# Altium project pcb_88.PrjPcb
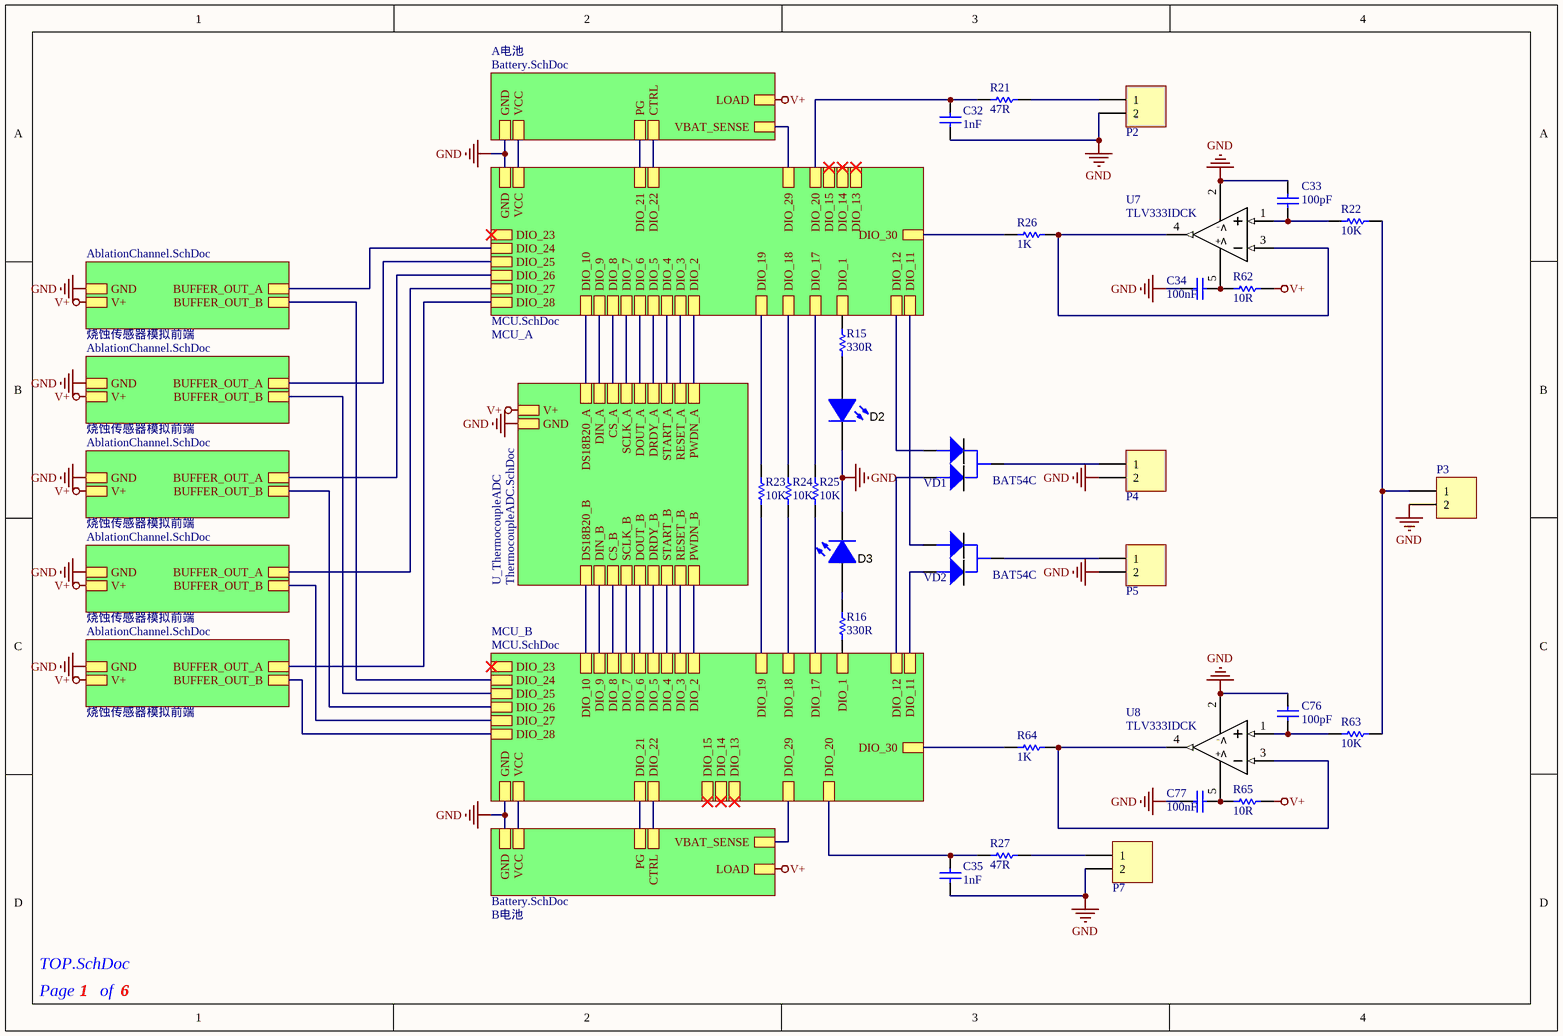
[diagram p0: TOP.SchDoc]
6 sheets, 395 parts. Net scope: hierarchical (ports join the sheet entries above them; power ports are global).
Board file: pcb_88.PcbDoc
Sheets:
  TOP.SchDoc
    U_Battery = Battery.SchDoc
    U_MCU = MCU.SchDoc
    U_AblationChannel = AblationChannel.SchDoc
    U_MCU = MCU.SchDoc
    U_AblationChannel = AblationChannel.SchDoc
    U_AblationChannel = AblationChannel.SchDoc
    U_AblationChannel = AblationChannel.SchDoc
    U_AblationChannel = AblationChannel.SchDoc
    U_Battery = Battery.SchDoc
    U_ThermocoupleADC = ThermocoupleADC.SchDoc
      U_Thermocouple channel = ThermocoupleFrontEnd.SchDoc
      U_Thermocouple channel = ThermocoupleFrontEnd.SchDoc
      U_Thermocouple channel = ThermocoupleFrontEnd.SchDoc
      U_Thermocouple channel = ThermocoupleFrontEnd.SchDoc
      U_Thermocouple channel = ThermocoupleFrontEnd.SchDoc

## Sheet TOP.SchDoc
size A4; DrawnBy: YuJian; SheetNumber: 1; SheetTotal: 6

### Parts
C32  1nF  [R0603_C]
C33  100pF  [R0603_C]
C34  100nF  [R0603_C]
C35  1nF  [R0603_C]
C76  100pF  [R0603_C]
C77  100nF  [R0603_C]
D2  MHT192WDT-C2  [LED_0603_RED]  (value not drawn)
D3  MHT192WDT-C2  [LED_0603_RED]  (value not drawn)
P2  Header 2  [CP1X2]  (value not drawn)
P3  Header 2  [CP1X2]  (value not drawn)
P4  Header 2  [CP1X2]  (value not drawn)
P5  Header 2  [CP1X2]  (value not drawn)
P7  Header 2  [CP1X2]  (value not drawn)
R15  330R  [R0603_R]
R16  330R  [R0603_R]
R21  47R  [R0603_R]
R22  10K  [R0603_R]
R23  10K  [R0603_R]
R24  10K  [R0603_R]
R25  10K  [R0603_R]
R26  1K  [R0603_R]
R27  47R  [R0603_R]
R62  10R  [R0603_R]
R63  10K  [R0603_R]
R64  1K  [R0603_R]
R65  10R  [R0603_R]
U7  TLV333IDCK  [DCK0005A_N]
U8  TLV333IDCK  [DCK0005A_N]
VD1  BAT54C  [SOT-23(SOT-23-3)]
VD2  BAT54C  [SOT-23(SOT-23-3)]

### Sub-sheets
U_AblationChannel = AblationChannel.SchDoc: BUFFER_OUT_A, GND, BUFFER_OUT_B, V+  | Parameter 2: 烧蚀传感器模拟前端
U_AblationChannel = AblationChannel.SchDoc: BUFFER_OUT_A, GND, BUFFER_OUT_B, V+  | Parameter 2: 烧蚀传感器模拟前端
U_AblationChannel = AblationChannel.SchDoc: BUFFER_OUT_A, GND, BUFFER_OUT_B, V+  | Parameter 2: 烧蚀传感器模拟前端
U_AblationChannel = AblationChannel.SchDoc: BUFFER_OUT_A, GND, BUFFER_OUT_B, V+  | Parameter 2: 烧蚀传感器模拟前端
U_AblationChannel = AblationChannel.SchDoc: BUFFER_OUT_A, GND, BUFFER_OUT_B, V+  | Parameter 2: 烧蚀传感器模拟前端
U_Battery = Battery.SchDoc: LOAD, CTRL, PG, VCC, GND, VBAT_SENSE  | Parameter 2: B电池
U_Battery = Battery.SchDoc: LOAD, CTRL, PG, VCC, GND, VBAT_SENSE  | Parameter 2: A电池
U_MCU = MCU.SchDoc: DIO_2, DIO_3, DIO_4, DIO_5, DIO_6, DIO_1, DIO_8, DIO_9, DIO_10, DIO_11, DIO_12, DIO_13, DIO_14, DIO_15, DIO_17, DIO_18, DIO_19, DIO_20, DIO_21, DIO_22, DIO_23, DIO_24, DIO_25, DIO_26, DIO_27, DIO_28, DIO_29, DIO_30, GND, VCC, DIO_7  | Parameter 2: MCU_B
U_MCU = MCU.SchDoc: DIO_2, DIO_3, DIO_4, DIO_5, DIO_6, DIO_1, DIO_8, DIO_9, DIO_10, DIO_11, DIO_12, DIO_13, DIO_14, DIO_15, DIO_17, DIO_18, DIO_19, DIO_20, DIO_21, DIO_22, DIO_23, DIO_24, DIO_25, DIO_26, DIO_27, DIO_28, DIO_29, DIO_30, GND, VCC, DIO_7  | Parameter 2: MCU_A
U_ThermocoupleADC = ThermocoupleADC.SchDoc: GND, V+, DS18B20_A, DRDY_A, SCLK_A, CS_A, DIN_A, DOUT_A, PWDN_A, START_A, RESET_A, DS18B20_B, DRDY_B, SCLK_B, CS_B, DIN_B, DOUT_B, PWDN_B, START_B, RESET_B

### Nets
GND: C32.1 C33.1 C34.1 C35.1 C76.1 C77.1 D2.2(K) D3.2(K) P2.2 P3.2 P4.2 P5.2 P7.2 U7.2(V-) U8.2(V-) ; sheet U_Battery/GND, sheet U_MCU/GND, sheet U_AblationChannel/GND, sheet U_MCU/GND, sheet U_AblationChannel/GND, sheet U_AblationChannel/GND, sheet U_AblationChannel/GND, sheet U_AblationChannel/GND, sheet U_Battery/GND, sheet U_ThermocoupleADC/GND
V+: R62.2 R65.2 ; sheet U_Battery/LOAD, sheet U_AblationChannel/V+, sheet U_AblationChannel/V+, sheet U_AblationChannel/V+, sheet U_AblationChannel/V+, sheet U_AblationChannel/V+, sheet U_Battery/LOAD, sheet U_ThermocoupleADC/V+
VCC: sheet U_Battery/VCC, sheet U_MCU/VCC, sheet U_MCU/VCC, sheet U_Battery/VCC
NetC32_2: C32.2 R21.1 ; sheet U_MCU/DIO_20
NetC33_2: C33.2 R22.2 U7.1(IN+)
NetC34_2: C34.2 R62.1 U7.5(V+)
NetC35_2: C35.2 R27.1 ; sheet U_MCU/DIO_20
NetC76_2: C76.2 R63.2 U8.1(IN+)
NetC77_2: C77.2 R65.1 U8.5(V+)
NetD2_1: D2.1(A) R15.1
NetD3_1: D3.1(A) R16.2
NetP2_1: P2.1 R21.2
NetP3_1: P3.1 R22.1 R63.1
NetP4_1: P4.1 VD1.3(K)
NetP5_1: P5.1 VD2.3(K)
NetP7_1: P7.1 R27.2
NetR3A_2: sheet U_AblationChannel/BUFFER_OUT_A, sheet U_MCU/DIO_24
NetR3B_2: sheet U_MCU/DIO_25, sheet U_AblationChannel/BUFFER_OUT_A
NetR3C_2: sheet U_MCU/DIO_26, sheet U_AblationChannel/BUFFER_OUT_A
NetR3D_2: sheet U_MCU/DIO_27, sheet U_AblationChannel/BUFFER_OUT_A
NetR3E_2: sheet U_MCU/DIO_28, sheet U_AblationChannel/BUFFER_OUT_A
NetR6A_2: sheet U_MCU/DIO_24, sheet U_AblationChannel/BUFFER_OUT_B
NetR6B_2: sheet U_MCU/DIO_25, sheet U_AblationChannel/BUFFER_OUT_B
NetR6C_2: sheet U_MCU/DIO_26, sheet U_AblationChannel/BUFFER_OUT_B
NetR6D_2: sheet U_MCU/DIO_27, sheet U_AblationChannel/BUFFER_OUT_B
NetR6E_2: sheet U_MCU/DIO_28, sheet U_AblationChannel/BUFFER_OUT_B
NetR12A_1: sheet U_Battery/PG, sheet U_MCU/DIO_21
NetR12B_1: sheet U_MCU/DIO_21, sheet U_Battery/PG
NetR14A_2: sheet U_Battery/CTRL, sheet U_MCU/DIO_22
NetR14B_2: sheet U_MCU/DIO_22, sheet U_Battery/CTRL
NetR15_2: R15.2 ; sheet U_MCU/DIO_1
NetR16_1: R16.1 ; sheet U_MCU/DIO_1
NetR23_1: R23.1 ; sheet U_MCU/DIO_19
NetR23_2: R23.2 ; sheet U_MCU/DIO_19
NetR24_1: R24.1 ; sheet U_MCU/DIO_18
NetR24_2: R24.2 ; sheet U_MCU/DIO_18
NetR25_1: R25.1 ; sheet U_MCU/DIO_17
NetR25_2: R25.2 ; sheet U_MCU/DIO_17
NetR26_1: R26.1 U7.3(IN-) U7.4(OUT)
NetR26_2: R26.2 ; sheet U_MCU/DIO_30
NetR28_2: sheet U_MCU/DIO_5, sheet U_ThermocoupleADC/DRDY_A
NetR30_2: sheet U_MCU/DIO_8, sheet U_ThermocoupleADC/CS_A
NetR31_2: sheet U_MCU/DIO_7, sheet U_ThermocoupleADC/SCLK_A
NetR32_2: sheet U_MCU/DIO_9, sheet U_ThermocoupleADC/DIN_A
NetR33_2: sheet U_MCU/DIO_6, sheet U_ThermocoupleADC/DOUT_A
NetR40_1: sheet U_MCU/DIO_10, sheet U_ThermocoupleADC/DS18B20_A
NetR41_2: sheet U_MCU/DIO_5, sheet U_ThermocoupleADC/DRDY_B
NetR43_2: sheet U_MCU/DIO_8, sheet U_ThermocoupleADC/CS_B
NetR44_2: sheet U_MCU/DIO_7, sheet U_ThermocoupleADC/SCLK_B
NetR45_2: sheet U_MCU/DIO_9, sheet U_ThermocoupleADC/DIN_B
NetR46_2: sheet U_MCU/DIO_6, sheet U_ThermocoupleADC/DOUT_B
NetR53_1: sheet U_MCU/DIO_10, sheet U_ThermocoupleADC/DS18B20_B
NetR64_1: R64.1 U8.3(IN-) U8.4(OUT)
NetR64_2: R64.2 ; sheet U_MCU/DIO_30
NetR68_2: sheet U_MCU/DIO_2, sheet U_ThermocoupleADC/PWDN_A
NetR69_2: sheet U_MCU/DIO_3, sheet U_ThermocoupleADC/RESET_A
NetR70_2: sheet U_MCU/DIO_4, sheet U_ThermocoupleADC/START_A
NetR71_2: sheet U_MCU/DIO_2, sheet U_ThermocoupleADC/PWDN_B
NetR72_2: sheet U_MCU/DIO_3, sheet U_ThermocoupleADC/RESET_B
NetR73_2: sheet U_MCU/DIO_4, sheet U_ThermocoupleADC/START_B
NetU5A_3: sheet U_Battery/VBAT_SENSE, sheet U_MCU/DIO_29
NetU5B_3: sheet U_MCU/DIO_29, sheet U_Battery/VBAT_SENSE
NetU9A_17: VD2.2(A2) ; sheet U_MCU/DIO_11
NetU9A_18: VD1.2(A2) ; sheet U_MCU/DIO_12
NetU9B_17: VD2.1(A1) ; sheet U_MCU/DIO_11
NetU9B_18: VD1.1(A1) ; sheet U_MCU/DIO_12

### Notes on the sheet
- Page
- of

### Library data of the parts
C32 C35 = 1nF/0603/50V: 精度 ±5% / 容值 1nF / 额定电压 50V / 温漂系数（介质材料) C0G; 厂家: FH(风华); 型号: 0603CG102J500NT; 封装: 0603; 类型: Capacitor; 订货编码: C1636
C33 C76 = 100pF/0603/50V: 精度 ±5% / 容值 100pF / 额定电压 50V / 温漂系数（介质材料) C0G; 厂家: FH(风华); 型号: 0603CG101J500NT; 封装: 0603; 类型: Capacitor; 订货编码: C1635
C34 C77 = 100nF/0603/50V: 精度 ±10% / 容值 100nF / 额定电压 50V / 温漂系数（介质材料) X7R; 厂家: FH(风华); 型号: 0603B104K500NT; 封装: 0603; 类型: Capacitor; 订货编码: C30926
D2 D3 = MHT192WDT-C2: LED SMD贴片0603顶部发光 / 黄色雾状胶体，高亮白色光 / 电压VF:2.6-3.1V@5mA / 亮度Iv:228-450mcd@5mA / 坐标x:0.3,y:0.3 / 发光角度:120deg; 厂家: MEIHUA(美华科技); 封装: 0603; 订货编码: C389521; 型号: MHT192WDT-C2; 类型: LED
P2-P5 P7 = Header 2: Header, 2-Pin; 厂家: /; System: Connector; 型号: /; 封装: /; 类型: /; 订货编码: /
R15 R16 = 330R/0603: 精度 ±1% / 温度系数 ±100ppm/℃ / 阻值 330Ω / 功率 0.1W; 厂家: FH(风华); 型号: RS-03K3300FT; 类型: Resistor; 订货编码: C125768; 封装: 0603
R21 R27 = 47R/0603: 精度 ±1% / 温度系数 ±100ppm/℃ / 阻值 47Ω / 功率 0.1W; 厂家: FH(风华); 型号: RS-03K47R0FT; 类型: Resistor; 订货编码: C140087; 封装: 0603
R22-R25 R63 = 10K/0603: 精度 ±1% / 温度系数 ±100ppm/℃ / 阻值 10kΩ / 功率 0.1W; 厂家: FH(风华); 型号: RS-03K1002FT; 类型: Resistor; 订货编码: C115324; 封装: 0603
R26 R64 = 1K/0603: 精度 ±1% / 温度系数 ±100ppm/℃ / 阻值 1kΩ / 功率 0.1W; 厂家: FH(风华); 型号: RS-03K1001FT; 类型: Resistor; 订货编码: C115325; 封装: 0603
R62 R65 = 10R/0603: 精度 ±1% / 阻值 10Ω / 温度系数 ±100ppm/℃ / 功率 0.1W; 厂家: FH(风华); 型号: RS-03K10R0FT; 类型: Resistor; 订货编码: C136596; 封装: 0603
U7 U8 = TLV333IDCK: 电源电压 1.8V ~ 5.5V, ±0.9V ~ 2.75V / 增益带宽积（GBP） 350kHz / 压摆率（SR） 0.16 V/us / 工作温度 -40°C ~ 125°C /; 厂家: TI(德州仪器); 封装: SC-70-5; 类型: 运放; 订货编码: C181502; 型号: TLV333IDCK
VD1 VD2 = BAT54C: 共阴极，IF=0.2A,VRRM=30V,VF=0.24V@0.1mA,IR=2uA@25V,trr=5ns,SOT23-3,-55℃～150℃; 厂家: Nexperia(安世); 型号: BAT54C,215; 封装: SOT-23-3; 类型: 肖特基二极管; 订货编码: C37704

## Sheet Battery.SchDoc
size A4; SheetNumber: 3; SheetTotal: 6
Used 2 times, as channels U_Battery, U_Battery. Parts and nets are listed once, with the designators drawn on the sheet.
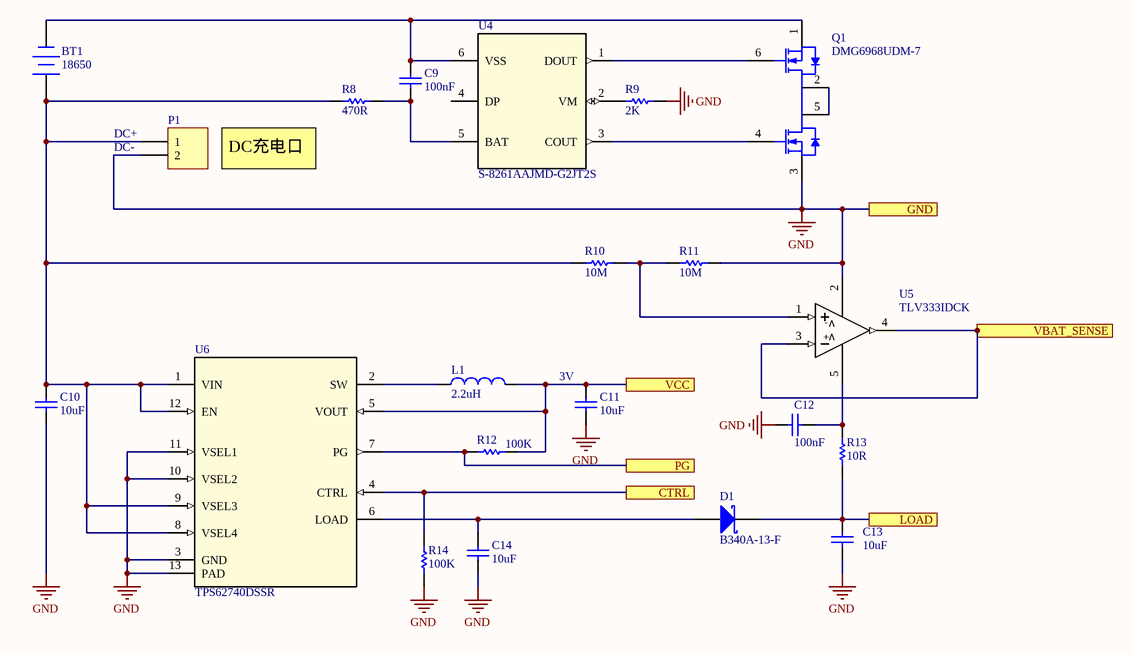
[diagram p1: Battery.SchDoc]

### Parts
BT1  18650  [CP1X2]
C9  100nF  [R0603_C]
C10  10uF  [R0805_C]
C11  10uF  [R0805_C]
C12  100nF  [R0603_C]
C13  10uF  [R0805_C]
C14  10uF  [R0805_C]
D1  B340A-13-F  [SMA(DO-214AC)_S2]
L1  2.2uH  [NR2016]
P1  Header 2  [CP1X2]  (value not drawn)
Q1  DMG6968UDM-7  [DBV0006A_N]
R8  470R  [R0603_R]
R9  2K  [R0603_R]
R10  10M  [R0603_R]
R11  10M  [R0603_R]
R12  100K  [R0603_R]
R13  10R  [R0603_R]
R14  100K  [R0603_R]
U4  S-8261AAJMD-G2JT2S  [DBV0006A_N]
U5  TLV333IDCK  [DCK0005A_N]
U6  TPS62740DSSR  [DSS0012A]

### Ports
CTRL, GND, LOAD, PG, VBAT_SENSE, VCC

### Nets
GND: C10.1 C11.1 C12.1 C13.1 C14.1 P1.2 Q1.3(S2) R9.2 R11.1 R14.1 U5.2(V-) U6.3(GND) U6.10(VSEL2) U6.11(VSEL1) U6.13(PAD) ; port GND
CTRL: R14.2 U6.4(CTRL) ; port CTRL
LOAD: C13.2 D1.2(K) R13.2 ; port LOAD
PG: R12.1 U6.7(PG) ; port PG
VBAT_SENSE: U5.3(IN-) U5.4(OUT) ; port VBAT_SENSE
VCC: C11.2 L1.2 R12.2 U6.5(VOUT) ; port VCC
NetBT1_1: BT1.1(+) C10.2 P1.1 R8.1 R10.2 U6.1(VIN) U6.8(VSEL4) U6.9(VSEL3) U6.12(EN)
NetBT1_2: BT1.2(-) C9.1 Q1.1(S1) U4.6(VSS)
NetC9_2: C9.2 R8.2 U4.5(BAT)
NetC12_2: C12.2 R13.1 U5.5(V+)
NetC14_2: C14.2 D1.1(A) U6.6(LOAD)
NetL1_1: L1.1 U6.2(SW)
NetQ1_2: Q1.2(D1/D2) Q1.5(D1/D2)
NetQ1_4: Q1.4(G2) U4.3(COUT)
NetQ1_6: Q1.6(G1) U4.1(DOUT)
NetR9_1: R9.1 U4.2(VM)
NetR10_1: R10.1 R11.2 U5.1(IN+)

Not connected (* = marked no-connect by the designer): U4 4(DP)

### Channels
U_Battery: designators end in A; ports CTRL=NetR14A_2 GND=GND LOAD=V+ PG=NetR12A_1 VBAT_SENSE=NetU5A_3 VCC=VCC
U_Battery: designators end in B; ports CTRL=NetR14B_2 GND=GND LOAD=V+ PG=NetR12B_1 VBAT_SENSE=NetU5B_3 VCC=VCC

### Notes on the sheet
- (near P1) DC+
- (near P1) DC-
- DC充电口
- (near C11) 3V
- Page
- of

### Library data of the parts
BT1 = Battery_18650_DIP: 18650单节直插电池仓; 型号: DIP-18650; 封装: DIP; 类型: 电池盒/电池座; System: Connector; 厂家: -; 订货编码: -
C9 C12 = 100nF/0603/50V: as C34 on sheet TOP
C10 C11 C13 C14 = 10uF/0805/16V: 精度 ±10% / 容值 10uF / 额定电压 16V / 温漂系数（介质材料) X7R; 厂家: FH(风华); 型号: 0805B106K160NT; 封装: 0805; 类型: Capacitor; 订货编码: C92341
D1 = B340A-13-F: 直流反向耐压（Vr） 40V / 平均整流电流（Io） 3A / 正向压降（Vf） 550mV @ 3A; 厂家: DIODES(美台); 封装: SMA; 类型: 肖特基二极管; 订货编码: C85098; 型号: B340A-13-F
L1 = 2.2uH/NR2016: 精度 ±20% / 饱和电流 1.3A / 温升电流1.15A / 直流电阻（内阻） 175mΩ / 电感值 2.2uH; 厂家: Sunlord(顺络); 型号: SPH201610U2R2MT; 类型: Inductor; 订货编码: C96796; 封装: NR2016
P1 = Header 2: Header, 2-Pin; 厂家: /; System: Connector; 型号: /; 封装: /; 类型: /; 订货编码: /
Q1 = DMG6968UDM-7: 漏源电压（Vdss） 20V / 连续漏极电流（Id）（25°C 时） 6.5A / 栅源极阈值电压 900mV @ 250uA / 漏源导通电阻 24mΩ @ 6.5A,4.5V / 最大功率耗散（Ta=25°C） 850mW / 类型 双N沟道(共漏); 厂家: DIODES(美台); 封装: SOT23-6; 类型: MOS(场效应管); 订货编码: C151635; 型号: DMG6968UDM-7
R8 = 470R/0603: 精度 ±1% / 温度系数 ±100ppm/℃ / 功率 0.1W; 厂家: FH(风华); 型号: RS-03K4700FT; 类型: Resistor; 订货编码: C116694; 封装: 0603
R9 = 2K/0603: 精度 ±1% / 阻值 2kΩ / 温度系数 ±100ppm/℃ / 功率 0.1W; 厂家: FH(风华); 型号: RS-03K2001FT; 类型: Resistor; 订货编码: C115336; 封装: 0603
R10 R11 = 10M/0603: 温度系数 ±250ppm/℃ / 精度 ±1% / 阻值 10MΩ / 功率 0.1W; 厂家: FH(风华); 型号: RS-03L1005FT; 类型: Resistor; 订货编码: C322040; 封装: 0603
R12 R14 = 100K/0603: 精度 ±1% / 阻值 100kΩ / 温度系数 ±100ppm/℃ / 功率 0.1W; 厂家: FH(风华); 型号: RS-03K1003FT; 类型: Resistor; 订货编码: C115320; 封装: 0603
R13 = 10R/0603: as R62 on sheet TOP
U4 = S-8261AAJMD-G2JT2S: 单节电池保护芯片 / 过充4.325V / 过放2.5V / 过流150mV; 厂家: ABLIC(艾普凌科); 封装: SOT23-6; 类型: 电池保护芯片; 订货编码: C125801; 型号: S-8261AAJMD-G2JT2S
U5 = TLV333IDCK: as U7 on sheet TOP; 型号: TLV333IDCK
U6 = TPS62740DSSR: DCDC; 厂家: TI(德州仪器); 类型: 电源芯片; 订货编码: C128606; 型号: TPS62740DSSR; 封装: DSS0012A

## Sheet MCU.SchDoc
size A4; DocumentNumber: 4; SheetNumber: 2; SheetTotal: 6
Used 2 times, as channels U_MCU, U_MCU. Parts and nets are listed once, with the designators drawn on the sheet.
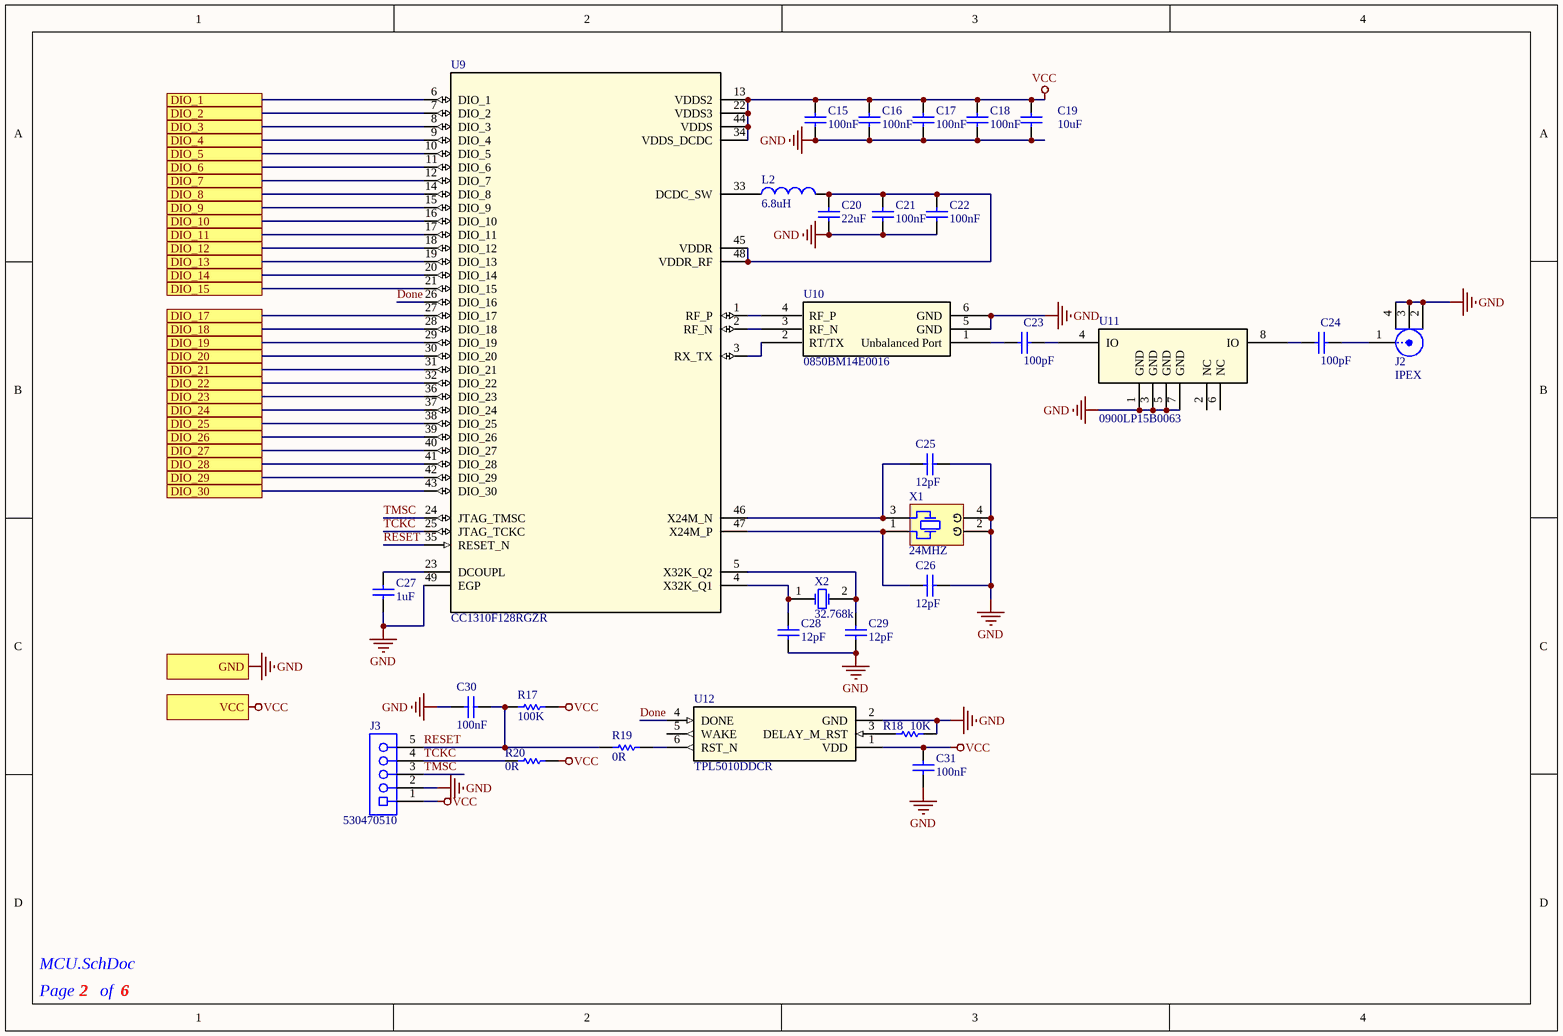
[diagram p2: MCU.SchDoc]

### Parts
C15  100nF  [R0603_C]
C16  100nF  [R0603_C]
C17  100nF  [R0603_C]
C18  100nF  [R0603_C]
C19  10uF  [R0805_C]
C20  22uF  [R0805_C]
C21  100nF  [R0603_C]
C22  100nF  [R0603_C]
C23  100pF  [R0402_C]
C24  100pF  [R0402_C]
C25  12pF  [R0402_C]
C26  12pF  [R0402_C]
C27  1uF  [R0603_C]
C28  12pF  [R0402_C]
C29  12pF  [R0402_C]
C30  100nF  [R0603_C]
C31  100nF  [R0603_C]
J2  IPEX  [molex-73412]
J3  530470510  [1.25mm_p5]
L2  6.8uH  [R0805_L]
R17  100K  [R0603_R]
R18  10K  [R0603_R]
R19  0R  [R0603_R]
R20  0R  [R0603_R]
U9  CC1310F128RGZR  [RGZ0048A]
U10  0850BM14E0016  [6P0603]
U11  0900LP15B0063  [8P0805]
U12  TPL5010DDCR  [DBV0006A_N]
X1  24MHZ  [SMD-3225]
X2  32.768k  [FC-135]

### Ports
DIO_1, DIO_2, DIO_3, DIO_4, DIO_5, DIO_6, DIO_7, DIO_8, DIO_9, DIO_10, DIO_11, DIO_12, DIO_13, DIO_14, DIO_15, DIO_17, DIO_18, DIO_19, DIO_20, DIO_21, DIO_22, DIO_23, DIO_24, DIO_25, DIO_26, DIO_27, DIO_28, DIO_29, DIO_30, GND, VCC

### Nets
GND: C15.1 C16.1 C17.1 C18.1 C19.1 C20.1 C21.1 C22.1 C25.1 C26.1 C27.1 C28.1 C29.1 C30.2 C31.1 J2.2 J2.3 J2.4 J3.2 R18.1 U9.49(EGP) U10.5(GND) U10.6(GND) U11.1(GND) U11.3(GND) U11.5(GND) U11.7(GND) U12.2(GND) X1.2(GND) X1.4(GND) ; port GND
VCC: C15.2 C16.2 C17.2 C18.2 C19.2 C31.2 J3.1 R17.2 R20.1 U9.13(VDDS2) U9.22(VDDS3) U9.34(VDDS_DCDC) U9.44(VDDS) U12.1(VDD) ; port VCC
DIO_1: U9.6(DIO_1) ; port DIO_1
DIO_2: U9.7(DIO_2) ; port DIO_2
DIO_3: U9.8(DIO_3) ; port DIO_3
DIO_4: U9.9(DIO_4) ; port DIO_4
DIO_5: U9.10(DIO_5) ; port DIO_5
DIO_6: U9.11(DIO_6) ; port DIO_6
DIO_7: U9.12(DIO_7) ; port DIO_7
DIO_8: U9.14(DIO_8) ; port DIO_8
DIO_9: U9.15(DIO_9) ; port DIO_9
DIO_10: U9.16(DIO_10) ; port DIO_10
DIO_11: U9.17(DIO_11) ; port DIO_11
DIO_12: U9.18(DIO_12) ; port DIO_12
DIO_13: U9.19(DIO_13) ; port DIO_13
DIO_14: U9.20(DIO_14) ; port DIO_14
DIO_15: U9.21(DIO_15) ; port DIO_15
DIO_17: U9.27(DIO_17) ; port DIO_17
DIO_18: U9.28(DIO_18) ; port DIO_18
DIO_19: U9.29(DIO_19) ; port DIO_19
DIO_20: U9.30(DIO_20) ; port DIO_20
DIO_21: U9.31(DIO_21) ; port DIO_21
DIO_22: U9.32(DIO_22) ; port DIO_22
DIO_23: U9.36(DIO_23) ; port DIO_23
DIO_24: U9.37(DIO_24) ; port DIO_24
DIO_25: U9.38(DIO_25) ; port DIO_25
DIO_26: U9.39(DIO_26) ; port DIO_26
DIO_27: U9.40(DIO_27) ; port DIO_27
DIO_28: U9.41(DIO_28) ; port DIO_28
DIO_29: U9.42(DIO_29) ; port DIO_29
DIO_30: U9.43(DIO_30) ; port DIO_30
Done: U9.26(DIO_16) U12.4(DONE)
RESET: C30.1 J3.5 R17.1 R19.2 U9.35(RESET_N)
TCKC: J3.4 R20.2 U9.25(JTAG_TCKC)
TMSC: J3.3 U9.24(JTAG_TMSC)
NetC20_2: C20.2 C21.2 C22.2 L2.2 U9.45(VDDR) U9.48(VDDR_RF)
NetC23_1: C23.1 U10.1(Unbalanced_Port)
NetC23_2: C23.2 U11.4(IO)
NetC24_1: C24.1 U11.8(IO)
NetC24_2: C24.2 J2.1
NetC25_2: C25.2 U9.46(X24M_N) X1.3
NetC26_2: C26.2 U9.47(X24M_P) X1.1
NetC27_2: C27.2 U9.23(DCOUPL)
NetC28_2: C28.2 U9.4(X32K_Q1) X2.1(OSC1)
NetC29_2: C29.2 U9.5(X32K_Q2) X2.2(OSC2)
NetL2_1: L2.1 U9.33(DCDC_SW)
NetR18_2: R18.2 U12.3(DELAY_M_RST)
NetR19_1: R19.1 U12.6(RST_N)
NetU9_1: U9.1(RF_P) U10.4(RF_P)
NetU9_2: U9.2(RF_N) U10.3(RF_N)
NetU9_3: U9.3(RX_TX) U10.2(RT/TX)

Not connected (* = marked no-connect by the designer): U11 2(NC) 6(NC); U12 5(WAKE)

### Channels
U_MCU: designators end in A; ports DIO_1=NetR16_1 DIO_2=NetR71_2 DIO_3=NetR72_2 DIO_4=NetR73_2 DIO_5=NetR41_2 DIO_6=NetR46_2 DIO_7=NetR44_2 DIO_8=NetR43_2 DIO_9=NetR45_2 DIO_10=NetR53_1 DIO_11=NetU9A_17 DIO_12=NetU9A_18 DIO_13=NetU9A_19 DIO_14=NetU9A_20 DIO_15=NetU9A_21 DIO_17=NetR25_1 DIO_18=NetR24_1 DIO_19=NetR23_1 DIO_20=NetC35_2 DIO_21=NetR12A_1 DIO_22=NetR14A_2 DIO_23=NetU9A_36 DIO_24=NetR6A_2 DIO_25=NetR6B_2 DIO_26=NetR6C_2 DIO_27=NetR6D_2 DIO_28=NetR6E_2 DIO_29=NetU5A_3 DIO_30=NetR64_2 GND=GND VCC=VCC
U_MCU: designators end in B; ports DIO_1=NetR15_2 DIO_2=NetR68_2 DIO_3=NetR69_2 DIO_4=NetR70_2 DIO_5=NetR28_2 DIO_6=NetR33_2 DIO_7=NetR31_2 DIO_8=NetR30_2 DIO_9=NetR32_2 DIO_10=NetR40_1 DIO_11=NetU9B_17 DIO_12=NetU9B_18 DIO_13=NetU9B_19 DIO_14=NetU9B_20 DIO_15=NetU9B_21 DIO_17=NetR25_2 DIO_18=NetR24_2 DIO_19=NetR23_2 DIO_20=NetC32_2 DIO_21=NetR12B_1 DIO_22=NetR14B_2 DIO_23=NetU9B_36 DIO_24=NetR3A_2 DIO_25=NetR3B_2 DIO_26=NetR3C_2 DIO_27=NetR3D_2 DIO_28=NetR3E_2 DIO_29=NetU5B_3 DIO_30=NetR26_2 GND=GND VCC=VCC

### Notes on the sheet
- Page
- of
- (in symbol X1E000021012700) G

### Library data of the parts
C15-C18 C21 C22 C30 C31 = 100nF/0603/50V: as C34 on sheet TOP
C19 = 10uF/0805/16V: as C10 on sheet Battery
C20 = 22uF/0805/16V: 精度 ±20% / 容值 22uF / 额定电压 16V / 温漂系数（介质材料) X5R; 厂家: FH(风华); 型号: 0805X226M160NT; 封装: 0805; 类型: Capacitor; 订货编码: C129302
C23 C24 = 100pF/0402/50V: 精度 ±5% / 容值 100pF / 额定电压 50V / 温漂系数（介质材料) C0G; 厂家: FH(风华); 型号: 0402CG101J500NT; 封装: 0402; 类型: Capacitor; 订货编码: C1546
C25 C26 C28 C29 = 12pF/0402/50V: 精度 ±1% / 容值 12pF / 额定电压 50V / 温漂系数（介质材料) C0G; 厂家: FH(风华); 型号: 0402CG120F500NT; 封装: 0402; 类型: Capacitor; 订货编码: C182477
C27 = 1uF/0603/50V: 精度 ±10% / 容值 1uF / 额定电压 50V / 温漂系数（介质材料) X7R; 厂家: FH(风华); 型号: 0603B105K500NT; 封装: 0603; 类型: Capacitor; 订货编码: C90540
J2 = 73412-0110: RF同轴连接器（天线座）; 厂家: MOLEX; 型号: 734120110; 封装: SMD; 类型: IPEX插座; 订货编码: C434806; System: Connector
J3 = Molex-530470510: MX1.25 直插 镀锡 5P 针座; 厂家: MOLEX; 封装: 1.25mm 5p; 类型: 连接器; 订货编码: C471412; System: Connector; 型号: 530470510
L2 = 6.8uH/0805: 精度 ±10% / 电感值 6.8uH / 直流电阻（内阻） 250mΩ / 额定电流 250mA; 厂家: FH(风华); 型号: CMP201209XD6R8KT; 封装: 0805; 类型: Inductor; 订货编码: C139247
R17 = 100K/0603: as R12 on sheet Battery
R18 = 10K/0603: as R22 on sheet TOP
R19 R20 = 0R/0603: 精度 ±1% / 阻值 0Ω / 功率 0.1W; 厂家: FH(风华); 型号: RS-03000FT; 类型: Resistor; 订货编码: C136582; 封装: 0603
U9 = CC1310F128RGZR: RF-MCU; 厂家: TI(德州仪器); 封装: VQFN-48; 类型: MCU; 订货编码: C84353; 型号: CC1310F128RGZR
U10 = 0850BM14E0016: 770 - 860 860 - 928MHz / -40°C to +85°C / Pmax 2W; 厂家: Johanson Technology; 类型: Balun; 型号: 0850BM14E0016; 封装: 6P0603; 订货编码: -
U11 = 0900LP15B0063: 863 - 960MHz / -40 to +85°C / 3Fo Attenuation (2589-2784MHz) 50dB / 2Fo Attenuation (1726-1856MHz) 59dB /; 厂家: Johanson Technology; 类型: 低通; 型号: 0900LP15B0063; 封装: 8P0805
U12 = TPL5010DDCR: 看门狗; 厂家: TI(德州仪器); 封装: SOT23-Thin-6; 订货编码: C473912; 型号: TPL5010DDCR; 类型: 看门狗
X1 = X1E000021012700: 等效串联电阻（ESR） 40Ω / 无源贴片晶振 / 主频 24MHz / 频率公差 ±10ppm / 负载电容值 9pF / 工作温度 -40℃~85℃; 厂家: EPSON(爱普生); 型号: X1A000061002100; 类型: 晶振; 订货编码: C89577; 封装: SMD-3225
X2 = FC-135 32.768KHz ±20ppm 12.5pF: 等效串联电阻（ESR） 70kΩ / 晶振类型 无源贴片晶振 / 主频 32.768KHz / 频率公差 ±20ppm / 负载电容值 12.5pF / 工作温度 -40℃~85℃; 厂家: EPSON(爱普生); 型号: Q13FC1350000400; 封装: SMD-3215_2P; 类型: 晶振; 订货编码: C32346

## Sheet AblationChannel.SchDoc
size A4; SheetNumber: 4; SheetTotal: 6
Used 5 times, as channels U_AblationChannel, U_AblationChannel, U_AblationChannel, U_AblationChannel, U_AblationChannel. Parts and nets are listed once, with the designators drawn on the sheet.
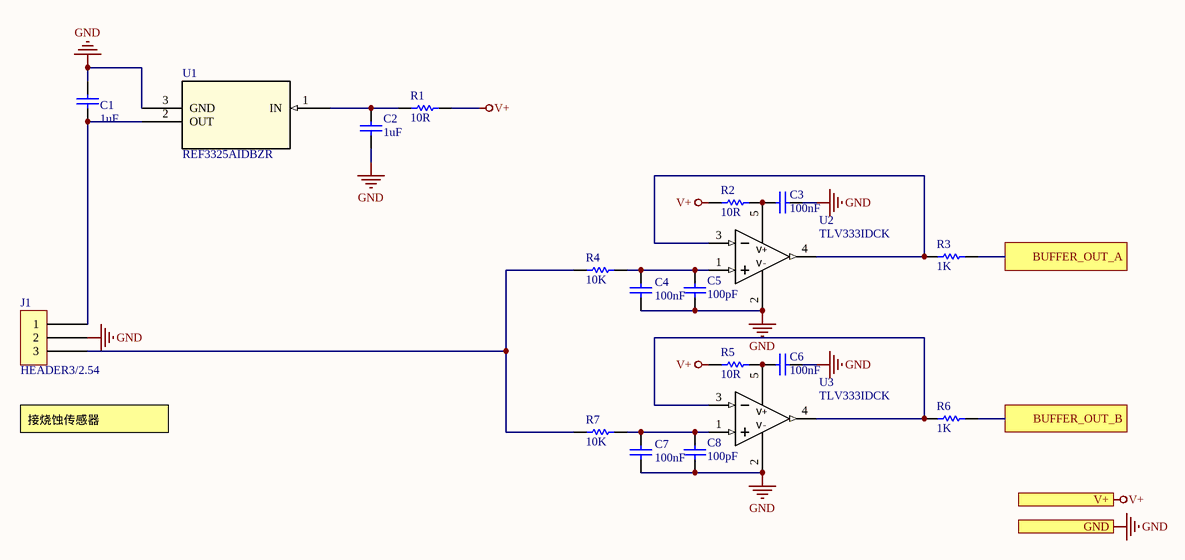
[diagram p3: AblationChannel.SchDoc]

### Parts
C1  1uF  [R0603_C]
C2  1uF  [R0603_C]
C3  100nF  [R0603_C]
C4  100nF  [R0603_C]
C5  100pF  [R0603_C]
C6  100nF  [R0603_C]
C7  100nF  [R0603_C]
C8  100pF  [R0603_C]
J1  HEADER3/2.54  [SIP3/2.54]
R1  10R  [R0603_R]
R2  10R  [R0603_R]
R3  1K  [R0603_R]
R4  10K  [R0603_R]
R5  10R  [R0603_R]
R6  1K  [R0603_R]
R7  10K  [R0603_R]
U1  REF3325AIDBZR  [SOT-23(SOT-23-3)]
U2  TLV333IDCK  [DCK0005A_N]
U3  TLV333IDCK  [DCK0005A_N]

### Ports
BUFFER_OUT_A, BUFFER_OUT_B, GND, V+

### Nets
GND: C1.1 C2.1 C3.1 C4.2 C5.1 C6.1 C7.2 C8.1 J1.2 U1.3(GND) U2.2(V-) U3.2(V-) ; port GND
V+: R1.1 R2.2 R5.2 ; port V+
BUFFER_OUT_A: R3.2 ; port BUFFER_OUT_A
BUFFER_OUT_B: R6.2 ; port BUFFER_OUT_B
NetC1_2: C1.2 J1.1 U1.2(OUT)
NetC2_2: C2.2 R1.2 U1.1(IN)
NetC3_2: C3.2 R2.1 U2.5(V+)
NetC4_1: C4.1 C5.2 R4.2 U2.1(IN+)
NetC6_2: C6.2 R5.1 U3.5(V+)
NetC7_1: C7.1 C8.2 R7.2 U3.1(IN+)
NetJ1_3: J1.3 R4.1 R7.1
NetR3_1: R3.1 U2.3(IN-) U2.4(OUT)
NetR6_1: R6.1 U3.3(IN-) U3.4(OUT)

### Channels
U_AblationChannel: designators end in A; ports BUFFER_OUT_A=NetR3A_2 BUFFER_OUT_B=NetR6A_2 GND=GND V+=V+
U_AblationChannel: designators end in B; ports BUFFER_OUT_A=NetR3B_2 BUFFER_OUT_B=NetR6B_2 GND=GND V+=V+
U_AblationChannel: designators end in C; ports BUFFER_OUT_A=NetR3C_2 BUFFER_OUT_B=NetR6C_2 GND=GND V+=V+
U_AblationChannel: designators end in D; ports BUFFER_OUT_A=NetR3D_2 BUFFER_OUT_B=NetR6D_2 GND=GND V+=V+
U_AblationChannel: designators end in E; ports BUFFER_OUT_A=NetR3E_2 BUFFER_OUT_B=NetR6E_2 GND=GND V+=V+

### Notes on the sheet
- 接烧蚀传感器
- Page
- of

### Library data of the parts
C1 C2 = 1uF/0603/50V: as C27 on sheet MCU
C3 C4 C6 C7 = 100nF/0603/50V: as C34 on sheet TOP
C5 C8 = 100pF/0603/50V: as C33 on sheet TOP
J1 = HEADER3/2.54: 3pin,单排,2.54mm间距; 厂家: /; System: Connector; 型号: /; 封装: /; 类型: /; 订货编码: /
R1 R2 R5 = 10R/0603: as R62 on sheet TOP
R3 R6 = 1K/0603: as R26 on sheet TOP
R4 R7 = 10K/0603: as R22 on sheet TOP
U1 = REF3325AIDBZR: 输出电压（最小值/固定） 2.5V / 输出电流 5mA / 输出电压（最大值） - / 输入电压 2.7 V ~ 5.5 V / 电源电流 8.5uA / 输出类型 固定 / 工作温度 -40°C ~ 125°C(TA) / 温度系数 30ppm/°C / 阴极电流 - / 精度 ±0.15% / 参考源类型 系列; 厂家: TI(德州仪器); 封装: SOT23-3; 类型: 电源参考; 订货编码: C69039; 型号: REF3325AIDBZR
U2 U3 = TLV333IDCK: as U7 on sheet TOP; 型号: TLV333IDCK

## Sheet ThermocoupleADC.SchDoc
size A3; SheetNumber: 5; SheetTotal: 6
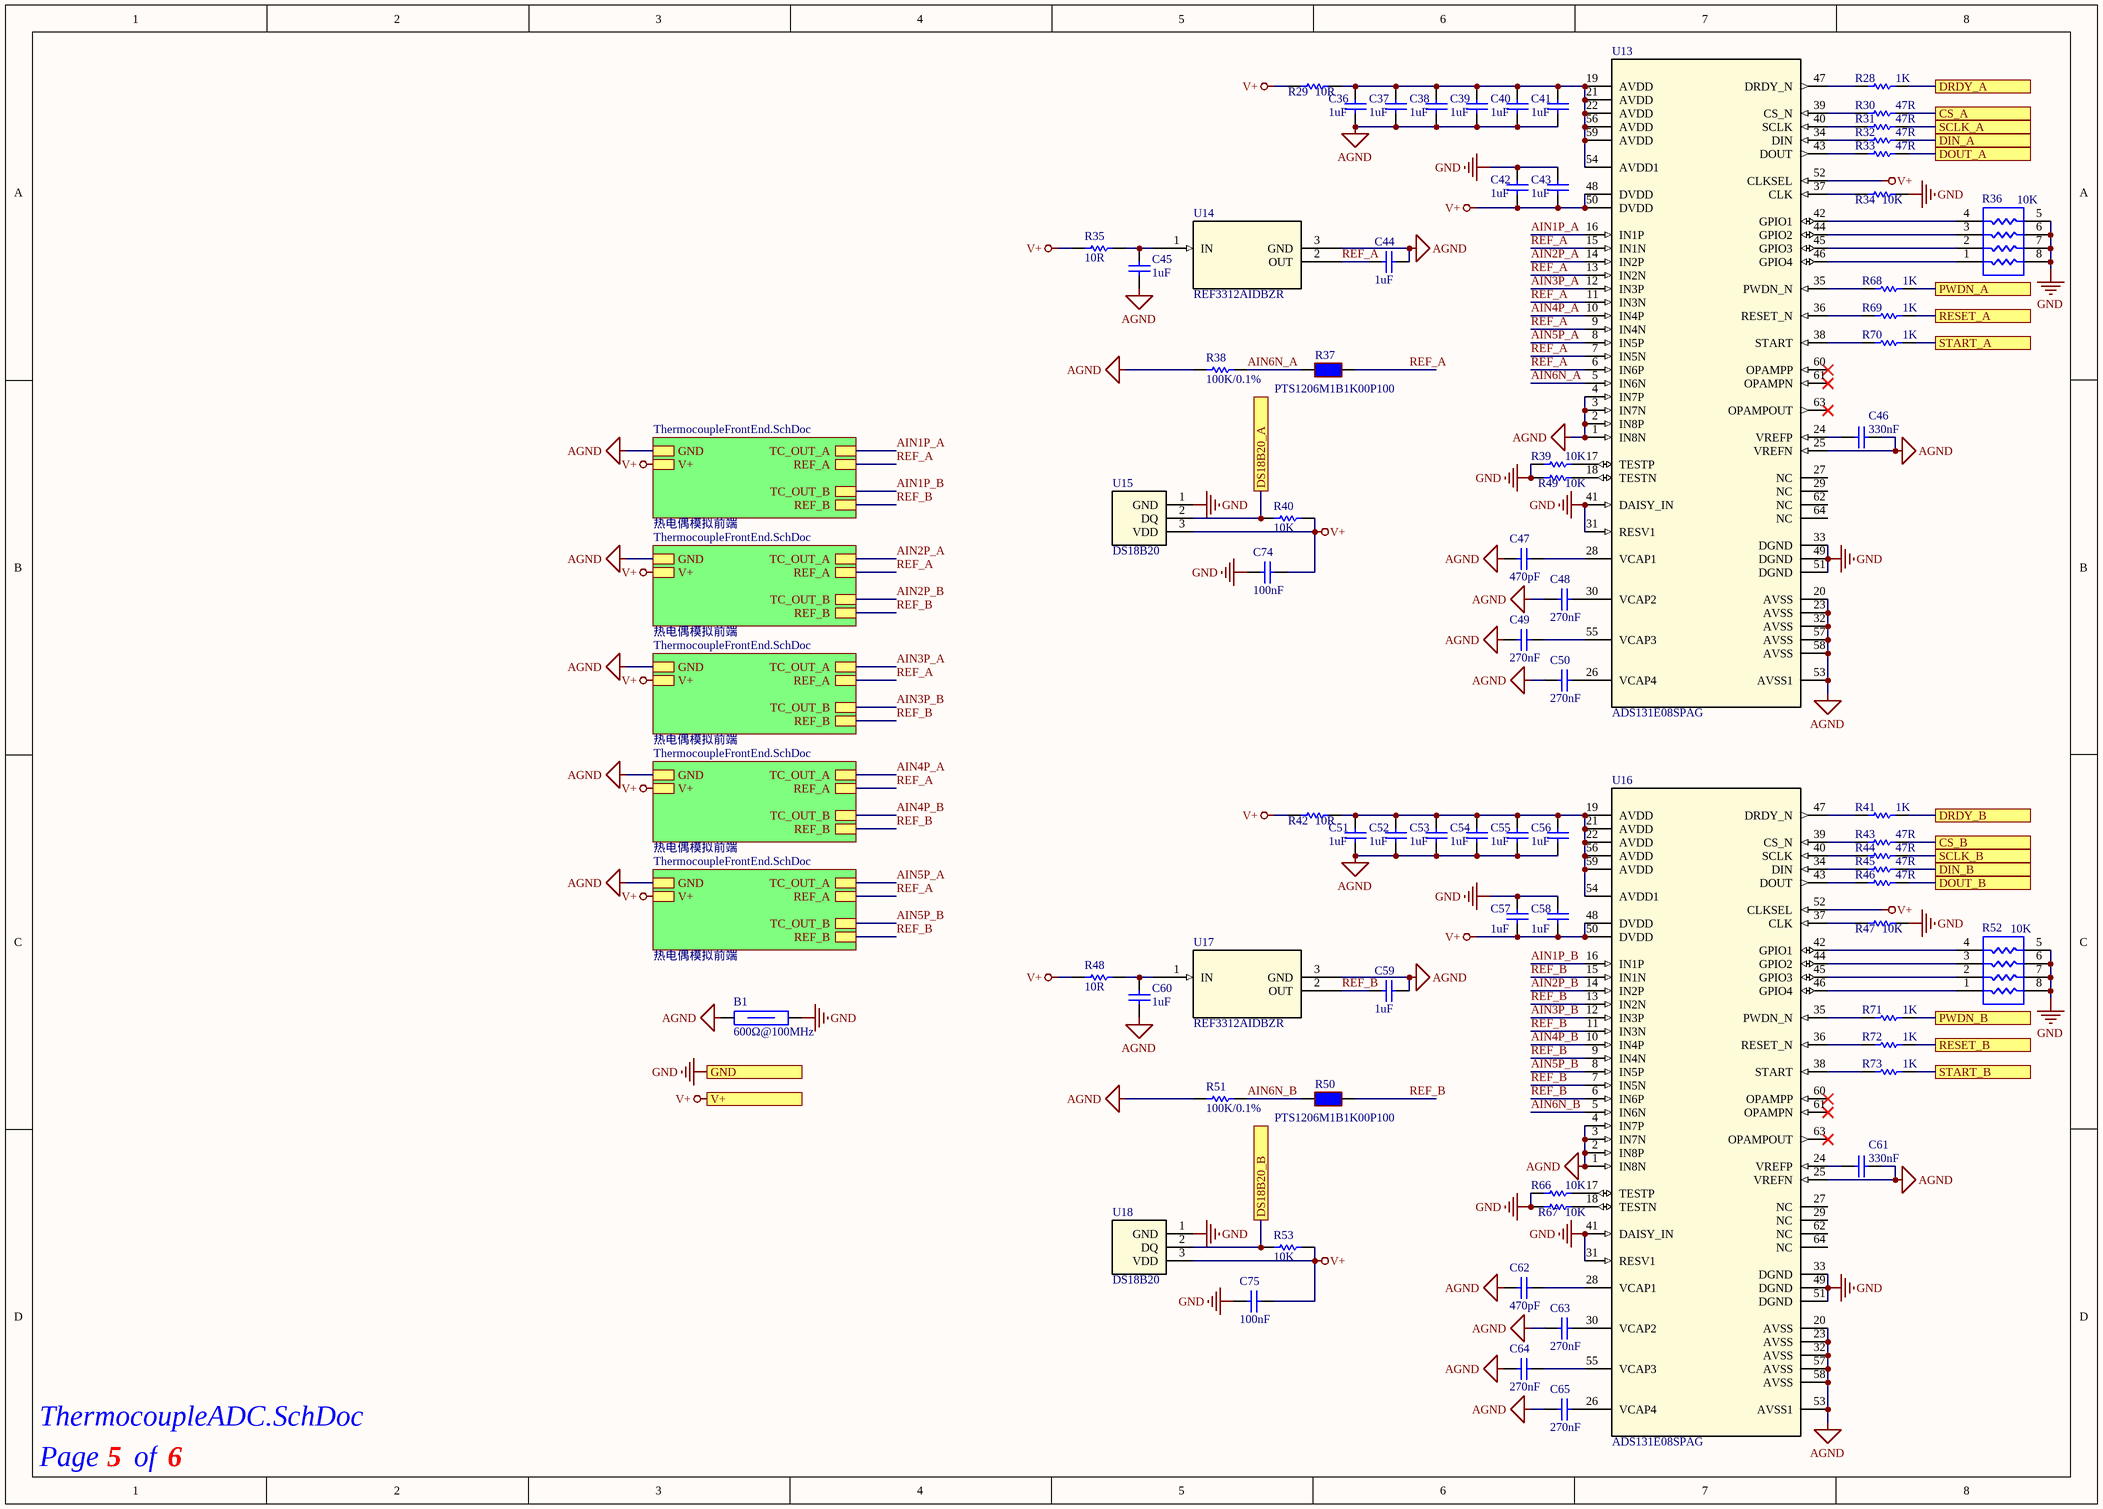
[diagram p4: ThermocoupleADC.SchDoc]

### Parts
B1  600Ω@100MHz  [R0805_L]
C36  1uF  [R0603_C]
C37  1uF  [R0603_C]
C38  1uF  [R0603_C]
C39  1uF  [R0603_C]
C40  1uF  [R0603_C]
C41  1uF  [R0603_C]
C42  1uF  [R0603_C]
C43  1uF  [R0603_C]
C44  1uF  [R0603_C]
C45  1uF  [R0603_C]
C46  330nF  [R0603_C]
C47  470pF  [R0603_C]
C48  270nF  [R0603_C]
C49  270nF  [R0603_C]
C50  270nF  [R0603_C]
C51  1uF  [R0603_C]
C52  1uF  [R0603_C]
C53  1uF  [R0603_C]
C54  1uF  [R0603_C]
C55  1uF  [R0603_C]
C56  1uF  [R0603_C]
C57  1uF  [R0603_C]
C58  1uF  [R0603_C]
C59  1uF  [R0603_C]
C60  1uF  [R0603_C]
C61  330nF  [R0603_C]
C62  470pF  [R0603_C]
C63  270nF  [R0603_C]
C64  270nF  [R0603_C]
C65  270nF  [R0603_C]
C74  100nF  [R0603_C]
C75  100nF  [R0603_C]
R28  1K  [R0603_R]
R29  10R  [R0603_R]
R30  47R  [R0603_R]
R31  47R  [R0603_R]
R32  47R  [R0603_R]
R33  47R  [R0603_R]
R34  10K  [R0603_R]
R35  10R  [R0603_R]
R36  10K  [R0603X4]
R37  PTS1206M1B1K00P100  [R1206_R]
R38  100K/0.1%  [R0603_R]
R39  10K  [R0603_R]
R40  10K  [R0603_R]
R41  1K  [R0603_R]
R42  10R  [R0603_R]
R43  47R  [R0603_R]
R44  47R  [R0603_R]
R45  47R  [R0603_R]
R46  47R  [R0603_R]
R47  10K  [R0603_R]
R48  10R  [R0603_R]
R49  10K  [R0603_R]
R50  PTS1206M1B1K00P100  [R1206_R]
R51  100K/0.1%  [R0603_R]
R52  10K  [R0603X4]
R53  10K  [R0603_R]
R66  10K  [R0603_R]
R67  10K  [R0603_R]
R68  1K  [R0603_R]
R69  1K  [R0603_R]
R70  1K  [R0603_R]
R71  1K  [R0603_R]
R72  1K  [R0603_R]
R73  1K  [R0603_R]
U13  ADS131E08SPAG  [TQFP-64]
U14  REF3312AIDBZR  [SOT-23(SOT-23-3)]
U15  DS18B20  [TO-92]
U16  ADS131E08SPAG  [TQFP-64]
U17  REF3312AIDBZR  [SOT-23(SOT-23-3)]
U18  DS18B20  [TO-92]

### Sub-sheets
U_Thermocouple channel = ThermocoupleFrontEnd.SchDoc: GND, V+, TC_OUT_B, TC_OUT_A, REF_A, REF_B  | Parameter 2: 热电偶模拟前端
U_Thermocouple channel = ThermocoupleFrontEnd.SchDoc: GND, V+, TC_OUT_B, TC_OUT_A, REF_A, REF_B  | Parameter 2: 热电偶模拟前端
U_Thermocouple channel = ThermocoupleFrontEnd.SchDoc: GND, V+, TC_OUT_B, TC_OUT_A, REF_A, REF_B  | Parameter 2: 热电偶模拟前端
U_Thermocouple channel = ThermocoupleFrontEnd.SchDoc: GND, V+, TC_OUT_B, TC_OUT_A, REF_A, REF_B  | Parameter 2: 热电偶模拟前端
U_Thermocouple channel = ThermocoupleFrontEnd.SchDoc: GND, V+, TC_OUT_B, TC_OUT_A, REF_A, REF_B  | Parameter 2: 热电偶模拟前端

### Ports
CS_A, CS_B, DIN_A, DIN_B, DOUT_A, DOUT_B, DRDY_A, DRDY_B, DS18B20_A, DS18B20_B, GND, PWDN_A, PWDN_B, RESET_A, RESET_B, SCLK_A, SCLK_B, START_A, START_B, V+

### Nets
AGND: B1.2 C36.1 C37.1 C38.1 C39.1 C40.1 C41.1 C44.1 C45.1 C46.1 C47.2 C48.2 C49.2 C50.2 C51.1 C52.1 C53.1 C54.1 C55.1 C56.1 C59.1 C60.1 C61.1 C62.2 C63.2 C64.2 C65.2 R38.2 R51.2 U13.1(IN8N) U13.2(IN8P) U13.3(IN7N) U13.4(IN7P) U13.20(AVSS) U13.23(AVSS) U13.25(VREFN) U13.32(AVSS) U13.53(AVSS1) U13.57(AVSS) U13.58(AVSS) U14.3(GND) U16.1(IN8N) U16.2(IN8P) U16.3(IN7N) U16.4(IN7P) U16.20(AVSS) U16.23(AVSS) U16.25(VREFN) U16.32(AVSS) U16.53(AVSS1) U16.57(AVSS) U16.58(AVSS) U17.3(GND) ; sheet U_Thermocouple channel/GND, sheet U_Thermocouple channel/GND, sheet U_Thermocouple channel/GND, sheet U_Thermocouple channel/GND, sheet U_Thermocouple channel/GND
GND: B1.1 C42.2 C43.2 C57.2 C58.2 C74.2 C75.2 R34.2 R36.5 R36.6 R36.7 R36.8 R39.2 R47.2 R49.2 R52.5 R52.6 R52.7 R52.8 R66.2 R67.2 U13.31(RESV1) U13.33(DGND) U13.41(DAISY_IN) U13.49(DGND) U13.51(DGND) U15.1(GND) U16.31(RESV1) U16.33(DGND) U16.41(DAISY_IN) U16.49(DGND) U16.51(DGND) U18.1(GND) ; port GND
V+: C42.1 C43.1 C57.1 C58.1 C74.1 C75.1 R29.1 R35.1 R40.2 R42.1 R48.1 R53.2 U13.48(DVDD) U13.50(DVDD) U13.52(CLKSEL) U15.3(VDD) U16.48(DVDD) U16.50(DVDD) U16.52(CLKSEL) U18.3(VDD) ; port V+, sheet U_Thermocouple channel/V+, sheet U_Thermocouple channel/V+, sheet U_Thermocouple channel/V+, sheet U_Thermocouple channel/V+, sheet U_Thermocouple channel/V+
AIN1P_A: U13.16(IN1P) ; sheet U_Thermocouple channel/TC_OUT_A
AIN1P_B: U16.16(IN1P) ; sheet U_Thermocouple channel/TC_OUT_B
AIN2P_A: U13.14(IN2P) ; sheet U_Thermocouple channel/TC_OUT_A
AIN2P_B: U16.14(IN2P) ; sheet U_Thermocouple channel/TC_OUT_B
AIN3P_A: U13.12(IN3P) ; sheet U_Thermocouple channel/TC_OUT_A
AIN3P_B: U16.12(IN3P) ; sheet U_Thermocouple channel/TC_OUT_B
AIN4P_A: U13.10(IN4P) ; sheet U_Thermocouple channel/TC_OUT_A
AIN4P_B: U16.10(IN4P) ; sheet U_Thermocouple channel/TC_OUT_B
AIN5P_A: U13.8(IN5P) ; sheet U_Thermocouple channel/TC_OUT_A
AIN5P_B: U16.8(IN5P) ; sheet U_Thermocouple channel/TC_OUT_B
AIN6N_A: R37.2 R38.1 U13.5(IN6N)
AIN6N_B: R50.2 R51.1 U16.5(IN6N)
REF_A: C44.2 R37.1 U13.6(IN6P) U13.7(IN5N) U13.9(IN4N) U13.11(IN3N) U13.13(IN2N) U13.15(IN1N) U14.2(OUT) ; sheet U_Thermocouple channel/REF_A, sheet U_Thermocouple channel/REF_A, sheet U_Thermocouple channel/REF_A, sheet U_Thermocouple channel/REF_A, sheet U_Thermocouple channel/REF_A
REF_B: C59.2 R50.1 U16.6(IN6P) U16.7(IN5N) U16.9(IN4N) U16.11(IN3N) U16.13(IN2N) U16.15(IN1N) U17.2(OUT) ; sheet U_Thermocouple channel/REF_B, sheet U_Thermocouple channel/REF_B, sheet U_Thermocouple channel/REF_B, sheet U_Thermocouple channel/REF_B, sheet U_Thermocouple channel/REF_B
NetC36_2: C36.2 C37.2 C38.2 C39.2 C40.2 C41.2 R29.2 U13.19(AVDD) U13.21(AVDD) U13.22(AVDD) U13.54(AVDD1) U13.56(AVDD) U13.59(AVDD)
NetC45_2: C45.2 R35.2 U14.1(IN)
NetC46_2: C46.2 U13.24(VREFP)
NetC47_1: C47.1 U13.28(VCAP1)
NetC48_1: C48.1 U13.30(VCAP2)
NetC49_1: C49.1 U13.55(VCAP3)
NetC50_1: C50.1 U13.26(VCAP4)
NetC51_2: C51.2 C52.2 C53.2 C54.2 C55.2 C56.2 R42.2 U16.19(AVDD) U16.21(AVDD) U16.22(AVDD) U16.54(AVDD1) U16.56(AVDD) U16.59(AVDD)
NetC60_2: C60.2 R48.2 U17.1(IN)
NetC61_2: C61.2 U16.24(VREFP)
NetC62_1: C62.1 U16.28(VCAP1)
NetC63_1: C63.1 U16.30(VCAP2)
NetC64_1: C64.1 U16.55(VCAP3)
NetC65_1: C65.1 U16.26(VCAP4)
NetR28_1: R28.1 U13.47(DRDY_N)
NetR28_2: R28.2 ; port DRDY_A
NetR30_1: R30.1 U13.39(CS_N)
NetR30_2: R30.2 ; port CS_A
NetR31_1: R31.1 U13.40(SCLK)
NetR31_2: R31.2 ; port SCLK_A
NetR32_1: R32.1 U13.34(DIN)
NetR32_2: R32.2 ; port DIN_A
NetR33_1: R33.1 U13.43(DOUT)
NetR33_2: R33.2 ; port DOUT_A
NetR34_1: R34.1 U13.37(CLK)
NetR36_1: R36.1 U13.46(GPIO4)
NetR36_2: R36.2 U13.45(GPIO3)
NetR36_3: R36.3 U13.44(GPIO2)
NetR36_4: R36.4 U13.42(GPIO1)
NetR39_1: R39.1 U13.17(TESTP)
NetR40_1: R40.1 U15.2(DQ) ; port DS18B20_A
NetR41_1: R41.1 U16.47(DRDY_N)
NetR41_2: R41.2 ; port DRDY_B
NetR43_1: R43.1 U16.39(CS_N)
NetR43_2: R43.2 ; port CS_B
NetR44_1: R44.1 U16.40(SCLK)
NetR44_2: R44.2 ; port SCLK_B
NetR45_1: R45.1 U16.34(DIN)
NetR45_2: R45.2 ; port DIN_B
NetR46_1: R46.1 U16.43(DOUT)
NetR46_2: R46.2 ; port DOUT_B
NetR47_1: R47.1 U16.37(CLK)
NetR49_1: R49.1 U13.18(TESTN)
NetR52_1: R52.1 U16.46(GPIO4)
NetR52_2: R52.2 U16.45(GPIO3)
NetR52_3: R52.3 U16.44(GPIO2)
NetR52_4: R52.4 U16.42(GPIO1)
NetR53_1: R53.1 U18.2(DQ) ; port DS18B20_B
NetR66_1: R66.1 U16.17(TESTP)
NetR67_1: R67.1 U16.18(TESTN)
NetR68_1: R68.1 U13.35(PWDN_N)
NetR68_2: R68.2 ; port PWDN_A
NetR69_1: R69.1 U13.36(RESET_N)
NetR69_2: R69.2 ; port RESET_A
NetR70_1: R70.1 U13.38(START)
NetR70_2: R70.2 ; port START_A
NetR71_1: R71.1 U16.35(PWDN_N)
NetR71_2: R71.2 ; port PWDN_B
NetR72_1: R72.1 U16.36(RESET_N)
NetR72_2: R72.2 ; port RESET_B
NetR73_1: R73.1 U16.38(START)
NetR73_2: R73.2 ; port START_B

Not connected (* = marked no-connect by the designer): U13 27(NC) 29(NC) 60(OPAMPP)* 61(OPAMPN)* 62(NC) 63(OPAMPOUT)* 64(NC); U16 27(NC) 29(NC) 60(OPAMPP)* 61(OPAMPN)* 62(NC) 63(OPAMPOUT)* 64(NC)

### Notes on the sheet
- Page
- of

### Library data of the parts
B1 = 600Ω@100MHz: 600Ω @ 100MHz / 线路数 1 / 额定电流（最大） 600mA / 直流电阻（DCR）（最大） 210mΩ; 厂家: muRata(村田); 型号: BLM21AG601SN1D; 封装: 0805; 类型: Bead; 订货编码: C85837
C36-C45 C51-C60 = 1uF/0603/50V: as C27 on sheet MCU
C46 C61 = 330nF/0603/25V: 精度 ±10% / 容值 330nF / 额定电压 25V / 温漂系数（介质材料) X7R; 厂家: FH(风华); 型号: 0603B334K250NT; 封装: 0603; 类型: Capacitor; 订货编码: C1615
C47 C62 = 470pF/0603/50V: 精度 ±5% / 容值 470pF / 额定电压 50V / 温漂系数（介质材料) C0G; 厂家: FH(风华); 型号: 0603CG471J500NT; 封装: 0603; 类型: Capacitor; 订货编码: C36252
C48-C50 C63-C65 = 270nF/0603/50V: 精度 ±10% / 容值 270nF / 额定电压 50V / 温漂系数（介质材料) X7R; 厂家: CCTC(三环); 型号: TCC0603X7R274K500CT; 封装: 0603; 类型: Capacitor; 订货编码: C376826
C74 C75 = 100nF/0603/50V: as C34 on sheet TOP
R28 R41 R68-R73 = 1K/0603: as R26 on sheet TOP
R29 R35 R42 R48 = 10R/0603: as R62 on sheet TOP
R30-R33 R43-R46 = 47R/0603: as R21 on sheet TOP
R34 R39 R40 R47 R49 R53 R66 R67 = 10K/0603: as R22 on sheet TOP
R36 R52 = 10K/0603X4: 10K / 电阻器数 4 / 精度 ±1% / 安装类型 表面贴装 / 每元件功率 1/16W / 温度系数 ±200ppm/℃; 厂家: UNI-ROYAL(厚声); 型号: 4D03WGF1002T5E; 类型: Resistor; 订货编码: C425238; 封装: 0603_x4
R37 R50 = PTS1206M1B1K00P100: PT1000; 厂家: FH(风华); 类型: Resistor; 订货编码: C320418; 封装: 1206; 型号: PTS1206M1B1K00P100
R38 R51 = 100K/0603/0.1%: 精度 ±0.1% / 阻值 100kΩ / 功率 0.1W; 厂家: YAGEO(国巨); 型号: RT0603BRE07100KL; 类型: Resistor; 订货编码: C326758; 封装: 0603
U13 U16 = ADS131E08SPAG: -; 厂家: TI(德州仪器); 类型: 模数转换芯片; 订货编码: C1520670; 型号: ADS131E08SPAG; 封装: TQFP-64
U14 U17 = REF3312AIDBZR: 电压参考; 厂家: TI(德州仪器); 封装: SOT23-3; 类型: 电源参考; 订货编码: C183104; 型号: REF3312AIDBZR
U15 U18 = DS18B20: 温度传感器2.5~5.5V; 厂家: UMW(友台半导体); 类型: 温度传感器; 订货编码: C473912; 型号: DS18B20; 封装: TO-92

## Sheet ThermocoupleFrontEnd.SchDoc
size A4; SheetNumber: 6; SheetTotal: 6
Used 5 times, as channels U_ThermocoupleADC/U_Thermocouple channel, U_ThermocoupleADC/U_Thermocouple channel, U_ThermocoupleADC/U_Thermocouple channel, U_ThermocoupleADC/U_Thermocouple channel, U_ThermocoupleADC/U_Thermocouple channel. Parts and nets are listed once, with the designators drawn on the sheet.
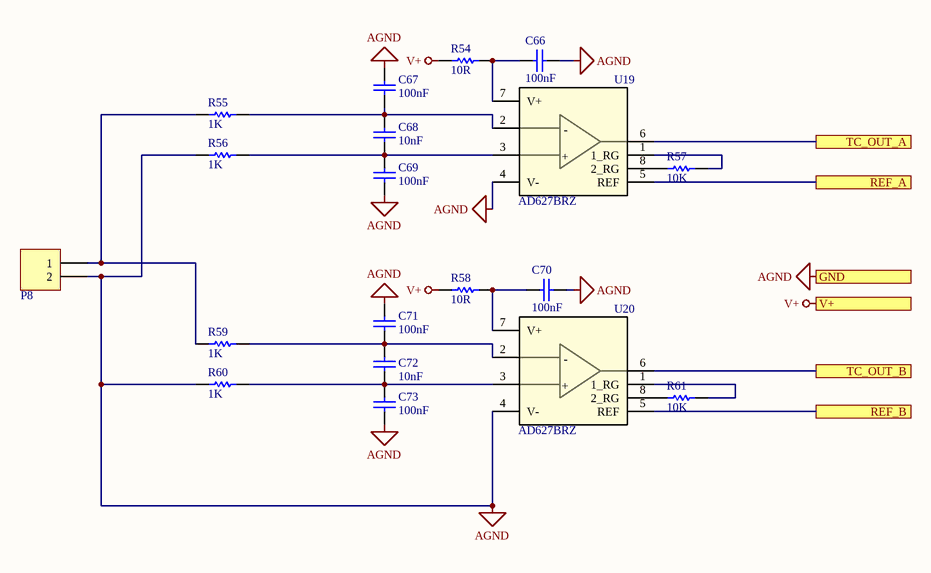
[diagram p5: ThermocoupleFrontEnd.SchDoc]

### Parts
C66  100nF  [R0603_C]
C67  100nF  [R0603_C]
C68  10nF  [R0603_C]
C69  100nF  [R0603_C]
C70  100nF  [R0603_C]
C71  100nF  [R0603_C]
C72  10nF  [R0603_C]
C73  100nF  [R0603_C]
P8  Header 2  [CP1X2]  (value not drawn)
R54  10R  [R0603_R]
R55  1K  [R0603_R]
R56  1K  [R0603_R]
R57  10K  [R0603_R]
R58  10R  [R0603_R]
R59  1K  [R0603_R]
R60  1K  [R0603_R]
R61  10K  [R0603_R]
U19  AD627BRZ  [SOP-8_150mil]
U20  AD627BRZ  [SOP-8_150mil]

### Ports
GND, REF_A, REF_B, TC_OUT_A, TC_OUT_B, V+

### Nets
AGND: C66.1 C67.1 C69.2 C70.1 C71.1 C73.2 P8.2 R56.1 R60.1 U19.4(V-) U20.4(V-) ; port GND
V+: R54.2 R58.2 ; port V+
REF_A: U19.5(REF) ; port REF_A
REF_B: U20.5(REF) ; port REF_B
TC_OUT_A: U19.6(VOUT) ; port TC_OUT_A
TC_OUT_B: U20.6(VOUT) ; port TC_OUT_B
NetC66_2: C66.2 R54.1 U19.7(V+)
NetC67_2: C67.2 C68.1 R55.2 U19.2(VIN-)
NetC68_2: C68.2 C69.1 R56.2 U19.3(VIN+)
NetC70_2: C70.2 R58.1 U20.7(V+)
NetC71_2: C71.2 C72.1 R59.2 U20.2(VIN-)
NetC72_2: C72.2 C73.1 R60.2 U20.3(VIN+)
NetP8_1: P8.1 R55.1 R59.1
NetR57_1: R57.1 U19.1(1_RG)
NetR57_2: R57.2 U19.8(2_RG)
NetR61_1: R61.1 U20.1(1_RG)
NetR61_2: R61.2 U20.8(2_RG)

### Channels
U_ThermocoupleADC/U_Thermocouple channel: designators end in A; ports GND=AGND REF_A=REF_A REF_B=REF_B TC_OUT_A=AIN1P_A TC_OUT_B=AIN1P_B V+=V+
U_ThermocoupleADC/U_Thermocouple channel: designators end in B; ports GND=AGND REF_A=REF_A REF_B=REF_B TC_OUT_A=AIN2P_A TC_OUT_B=AIN2P_B V+=V+
U_ThermocoupleADC/U_Thermocouple channel: designators end in C; ports GND=AGND REF_A=REF_A REF_B=REF_B TC_OUT_A=AIN3P_A TC_OUT_B=AIN3P_B V+=V+
U_ThermocoupleADC/U_Thermocouple channel: designators end in D; ports GND=AGND REF_A=REF_A REF_B=REF_B TC_OUT_A=AIN4P_A TC_OUT_B=AIN4P_B V+=V+
U_ThermocoupleADC/U_Thermocouple channel: designators end in E; ports GND=AGND REF_A=REF_A REF_B=REF_B TC_OUT_A=AIN5P_A TC_OUT_B=AIN5P_B V+=V+

### Notes on the sheet
- Page
- of
- (in symbol AD627BRZ) -; +

### Library data of the parts
C66 C67 C69-C71 C73 = 100nF/0603/50V: as C34 on sheet TOP
C68 C72 = 10nF/0603/C0G/50V: 精度 ±5% / 容值 10nF / 额定电压 50V / 温漂系数（介质材料) C0G; 厂家: FH(风华); 型号: 0603CG103J500NT; 封装: 0603; 类型: Capacitor; 订货编码: C82282
P8 = Header 2: Header, 2-Pin; 厂家: /; System: Connector; 型号: /; 封装: /; 类型: /; 订货编码: /
R54 R58 = 10R/0603: as R62 on sheet TOP
R55 R56 R59 R60 = 1K/0603: as R26 on sheet TOP
R57 R61 = 10K/0603: as R22 on sheet TOP
U19 U20 = AD627BRZ: 增益带宽积（GBP） 80kHz(-3dB) / 放大器组数 1 / 输出类型 Rail-to-Rail / 运放类型 Instrumentation / 各通道功耗 - / 压摆率（SR） 0.06 V/us / 工作温度 -40℃~85℃ / 电源电压 2.2V ~ 36V, ±1.1V ~ 18V; 厂家: TI(德州仪器); 封装: SOIC-8_150mil; 类型: 运放; 订货编码: C19137; 型号: AD627BRZ

## Nets that join several sheets
AGND: ThermocoupleADC (53 pins), U_ThermocoupleADC/U_Thermocouple channel (11 pins), U_ThermocoupleADC/U_Thermocouple channel (11 pins), U_ThermocoupleADC/U_Thermocouple channel (11 pins), U_ThermocoupleADC/U_Thermocouple channel (11 pins), U_ThermocoupleADC/U_Thermocouple channel (11 pins)
GND: TOP (15 pins), U_Battery (15 pins), U_MCU (30 pins), U_AblationChannel (12 pins), U_MCU (30 pins), U_AblationChannel (12 pins), U_AblationChannel (12 pins), U_AblationChannel (12 pins), U_AblationChannel (12 pins), U_Battery (15 pins), ThermocoupleADC (33 pins)
V+: TOP (R62.2 R65.2), U_Battery (C13A.2 D1A.2 R13A.2), U_AblationChannel (R1A.1 R2A.2 R5A.2), U_AblationChannel (R1B.1 R2B.2 R5B.2), U_AblationChannel (R1C.1 R2C.2 R5C.2), U_AblationChannel (R1D.1 R2D.2 R5D.2), U_AblationChannel (R1E.1 R2E.2 R5E.2), U_Battery (C13B.2 D1B.2 R13B.2), ThermocoupleADC (20 pins), U_ThermocoupleADC/U_Thermocouple channel (R54A.2 R58A.2), U_ThermocoupleADC/U_Thermocouple channel (R54B.2 R58B.2), U_ThermocoupleADC/U_Thermocouple channel (R54C.2 R58C.2), U_ThermocoupleADC/U_Thermocouple channel (R54D.2 R58D.2), U_ThermocoupleADC/U_Thermocouple channel (R54E.2 R58E.2)
VCC: U_Battery (C11A.2 L1A.2 R12A.2 U6A.5), U_MCU (14 pins), U_MCU (14 pins), U_Battery (C11B.2 L1B.2 R12B.2 U6B.5)
AIN1P_A: ThermocoupleADC (U13.16), U_ThermocoupleADC/U_Thermocouple channel (U19A.6)
AIN1P_B: ThermocoupleADC (U16.16), U_ThermocoupleADC/U_Thermocouple channel (U20A.6)
AIN2P_A: ThermocoupleADC (U13.14), U_ThermocoupleADC/U_Thermocouple channel (U19B.6)
AIN2P_B: ThermocoupleADC (U16.14), U_ThermocoupleADC/U_Thermocouple channel (U20B.6)
AIN3P_A: ThermocoupleADC (U13.12), U_ThermocoupleADC/U_Thermocouple channel (U19C.6)
AIN3P_B: ThermocoupleADC (U16.12), U_ThermocoupleADC/U_Thermocouple channel (U20C.6)
AIN4P_A: ThermocoupleADC (U13.10), U_ThermocoupleADC/U_Thermocouple channel (U19D.6)
AIN4P_B: ThermocoupleADC (U16.10), U_ThermocoupleADC/U_Thermocouple channel (U20D.6)
AIN5P_A: ThermocoupleADC (U13.8), U_ThermocoupleADC/U_Thermocouple channel (U19E.6)
AIN5P_B: ThermocoupleADC (U16.8), U_ThermocoupleADC/U_Thermocouple channel (U20E.6)
NetC32_2: TOP (C32.2 R21.1), U_MCU (U9B.30)
NetC35_2: TOP (C35.2 R27.1), U_MCU (U9A.30)
NetR3A_2: U_AblationChannel (R3A.2), U_MCU (U9B.37)
NetR3B_2: U_MCU (U9B.38), U_AblationChannel (R3B.2)
NetR3C_2: U_MCU (U9B.39), U_AblationChannel (R3C.2)
NetR3D_2: U_MCU (U9B.40), U_AblationChannel (R3D.2)
NetR3E_2: U_MCU (U9B.41), U_AblationChannel (R3E.2)
NetR6A_2: U_MCU (U9A.37), U_AblationChannel (R6A.2)
NetR6B_2: U_MCU (U9A.38), U_AblationChannel (R6B.2)
NetR6C_2: U_MCU (U9A.39), U_AblationChannel (R6C.2)
NetR6D_2: U_MCU (U9A.40), U_AblationChannel (R6D.2)
NetR6E_2: U_MCU (U9A.41), U_AblationChannel (R6E.2)
NetR12A_1: U_Battery (R12A.1 U6A.7), U_MCU (U9A.31)
NetR12B_1: U_MCU (U9B.31), U_Battery (R12B.1 U6B.7)
NetR14A_2: U_Battery (R14A.2 U6A.4), U_MCU (U9A.32)
NetR14B_2: U_MCU (U9B.32), U_Battery (R14B.2 U6B.4)
NetR15_2: TOP (R15.2), U_MCU (U9B.6)
NetR16_1: TOP (R16.1), U_MCU (U9A.6)
NetR23_1: TOP (R23.1), U_MCU (U9A.29)
NetR23_2: TOP (R23.2), U_MCU (U9B.29)
NetR24_1: TOP (R24.1), U_MCU (U9A.28)
NetR24_2: TOP (R24.2), U_MCU (U9B.28)
NetR25_1: TOP (R25.1), U_MCU (U9A.27)
NetR25_2: TOP (R25.2), U_MCU (U9B.27)
NetR26_2: TOP (R26.2), U_MCU (U9B.43)
NetR28_2: U_MCU (U9B.10), ThermocoupleADC (R28.2)
NetR30_2: U_MCU (U9B.14), ThermocoupleADC (R30.2)
NetR31_2: U_MCU (U9B.12), ThermocoupleADC (R31.2)
NetR32_2: U_MCU (U9B.15), ThermocoupleADC (R32.2)
NetR33_2: U_MCU (U9B.11), ThermocoupleADC (R33.2)
NetR40_1: U_MCU (U9B.16), ThermocoupleADC (R40.1 U15.2)
NetR41_2: U_MCU (U9A.10), ThermocoupleADC (R41.2)
NetR43_2: U_MCU (U9A.14), ThermocoupleADC (R43.2)
NetR44_2: U_MCU (U9A.12), ThermocoupleADC (R44.2)
NetR45_2: U_MCU (U9A.15), ThermocoupleADC (R45.2)
NetR46_2: U_MCU (U9A.11), ThermocoupleADC (R46.2)
NetR53_1: U_MCU (U9A.16), ThermocoupleADC (R53.1 U18.2)
NetR64_2: TOP (R64.2), U_MCU (U9A.43)
NetR68_2: U_MCU (U9B.7), ThermocoupleADC (R68.2)
NetR69_2: U_MCU (U9B.8), ThermocoupleADC (R69.2)
NetR70_2: U_MCU (U9B.9), ThermocoupleADC (R70.2)
NetR71_2: U_MCU (U9A.7), ThermocoupleADC (R71.2)
NetR72_2: U_MCU (U9A.8), ThermocoupleADC (R72.2)
NetR73_2: U_MCU (U9A.9), ThermocoupleADC (R73.2)
NetU5A_3: U_Battery (U5A.3 U5A.4), U_MCU (U9A.42)
NetU5B_3: U_MCU (U9B.42), U_Battery (U5B.3 U5B.4)
NetU9A_17: TOP (VD2.2), U_MCU (U9A.17)
NetU9A_18: TOP (VD1.2), U_MCU (U9A.18)
NetU9B_17: TOP (VD2.1), U_MCU (U9B.17)
NetU9B_18: TOP (VD1.1), U_MCU (U9B.18)
REF_A: ThermocoupleADC (9 pins), U_ThermocoupleADC/U_Thermocouple channel (U19A.5), U_ThermocoupleADC/U_Thermocouple channel (U19B.5), U_ThermocoupleADC/U_Thermocouple channel (U19C.5), U_ThermocoupleADC/U_Thermocouple channel (U19D.5), U_ThermocoupleADC/U_Thermocouple channel (U19E.5)
REF_B: ThermocoupleADC (9 pins), U_ThermocoupleADC/U_Thermocouple channel (U20A.5), U_ThermocoupleADC/U_Thermocouple channel (U20B.5), U_ThermocoupleADC/U_Thermocouple channel (U20C.5), U_ThermocoupleADC/U_Thermocouple channel (U20D.5), U_ThermocoupleADC/U_Thermocouple channel (U20E.5)

## Assembly variants
高等级阻感容: not fitted BT1A BT1B D2 D3 J1A J1B J1C J1D J1E P1A P1B P2 P3 P4 P5 P7 P8A P8B P8C P8D P8E; alternate parts B1 -> PB2012-601/1A5, R20A -> RMZ1608-B-T-30, R20B -> RMZ1608-B-T-30, R19B -> RMZ1608-B-T-30, R19A -> RMZ1608-B-T-30, R23 -> RMK1608-K-B-1002-F, R26 -> RMK1608-K-B-1001-F, R55C -> RMK1608-K-B-1001-F, R56D -> RMK1608-K-B-1001-F, R55A -> RMK1608-K-B-1001-F, R55B -> RMK1608-K-B-1001-F, R41 -> RMK1608-K-B-1001-F, R25 -> RMK1608-K-B-1002-F, R24 -> RMK1608-K-B-1002-F, R56C -> RMK1608-K-B-1001-F, R56B -> RMK1608-K-B-1001-F, R56A -> RMK1608-K-B-1001-F, R55E -> RMK1608-K-B-1001-F, R55D -> RMK1608-K-B-1001-F, R28 -> RMK1608-K-B-1001-F, R56E -> RMK1608-K-B-1001-F, R64 -> RMK1608-K-B-1001-F, R59A -> RMK1608-K-B-1001-F, R60E -> RMK1608-K-B-1001-F, R59C -> RMK1608-K-B-1001-F, R60D -> RMK1608-K-B-1001-F, R59B -> RMK1608-K-B-1001-F, R60A -> RMK1608-K-B-1001-F, R60C -> RMK1608-K-B-1001-F, R59E -> RMK1608-K-B-1001-F, R59D -> RMK1608-K-B-1001-F, R60B -> RMK1608-K-B-1001-F, R3A -> RMK1608-K-B-1001-F, R3B -> RMK1608-K-B-1001-F, R6E -> RMK1608-K-B-1001-F, R3E -> RMK1608-K-B-1001-F, R6D -> RMK1608-K-B-1001-F, R6C -> RMK1608-K-B-1001-F, R3D -> RMK1608-K-B-1001-F, R6B -> RMK1608-K-B-1001-F, R6A -> RMK1608-K-B-1001-F, R3C -> RMK1608-K-B-1001-F, C32 -> CT41G-0603-X7R-50V-102-K-N, C35 -> CT41G-0603-X7R-50V-102-K-N, C1A -> CT41G-0603-X7R-25V-105-K-N, C1E -> CT41G-0603-X7R-25V-105-K-N, C2E -> CT41G-0603-X7R-25V-105-K-N, C2B -> CT41G-0603-X7R-25V-105-K-N, C2A -> CT41G-0603-X7R-25V-105-K-N, C1B -> CT41G-0603-X7R-25V-105-K-N, C2D -> CT41G-0603-X7R-25V-105-K-N, C1C -> CT41G-0603-X7R-25V-105-K-N, C1D -> CT41G-0603-X7R-25V-105-K-N, C2C -> CT41G-0603-X7R-25V-105-K-N, C27B -> CT41G-0603-X7R-25V-105-K-N, C27A -> CT41G-0603-X7R-25V-105-K-N, C45 -> CT41G-0603-X7R-25V-105-K-N, C55 -> CT41G-0603-X7R-25V-105-K-N, C44 -> CT41G-0603-X7R-25V-105-K-N, C56 -> CT41G-0603-X7R-25V-105-K-N, C36 -> CT41G-0603-X7R-25V-105-K-N, C37 -> CT41G-0603-X7R-25V-105-K-N, C57 -> CT41G-0603-X7R-25V-105-K-N, C38 -> CT41G-0603-X7R-25V-105-K-N, C39 -> CT41G-0603-X7R-25V-105-K-N, C58 -> CT41G-0603-X7R-25V-105-K-N, C51 -> CT41G-0603-X7R-25V-105-K-N, C40 -> CT41G-0603-X7R-25V-105-K-N, C41 -> CT41G-0603-X7R-25V-105-K-N, C59 -> CT41G-0603-X7R-25V-105-K-N, C52 -> CT41G-0603-X7R-25V-105-K-N, C42 -> CT41G-0603-X7R-25V-105-K-N, C53 -> CT41G-0603-X7R-25V-105-K-N, C43 -> CT41G-0603-X7R-25V-105-K-N, C60 -> CT41G-0603-X7R-25V-105-K-N, C54 -> CT41G-0603-X7R-25V-105-K-N, R9A -> RMK1608-K-B-2001-F, R9B -> RMK1608-K-B-2001-F, L2A -> PI2012G6R8M, L2B -> PI2012G6R8M, R22 -> RMK1608-K-B-1002-F, R7D -> RMK1608-K-B-1002-F, R47 -> RMK1608-K-B-1002-F, R18A -> RMK1608-K-B-1002-F, R39 -> RMK1608-K-B-1002-F, R53 -> RMK1608-K-B-1002-F, R18B -> RMK1608-K-B-1002-F, R36 -> RNK5084-M-E-1001-F, R40 -> RMK1608-K-B-1002-F, R49 -> RMK1608-K-B-1002-F, R34 -> RMK1608-K-B-1002-F, R52 -> RNK5084-M-E-1001-F, R7E -> RMK1608-K-B-1002-F, R57E -> RMK1608-K-B-1002-F, R67 -> RMK1608-K-B-1002-F, R61C -> RMK1608-K-B-1002-F, R57D -> RMK1608-K-B-1002-F, R63 -> RMK1608-K-B-1002-F, R66 -> RMK1608-K-B-1002-F, R61B -> RMK1608-K-B-1002-F, R61A -> RMK1608-K-B-1002-F, R57B -> RMK1608-K-B-1002-F, R61E -> RMK1608-K-B-1002-F, R57A -> RMK1608-K-B-1002-F, R61D -> RMK1608-K-B-1002-F, R57C -> RMK1608-K-B-1002-F, R7C -> RMK1608-K-B-1002-F, R4E -> RMK1608-K-B-1002-F, R4D -> RMK1608-K-B-1002-F, R7B -> RMK1608-K-B-1002-F, R4C -> RMK1608-K-B-1002-F, R7A -> RMK1608-K-B-1002-F, R4B -> RMK1608-K-B-1002-F, R4A -> RMK1608-K-B-1002-F, R10A -> RMK1608-K-B-1005-F, R11A -> RMK1608-K-B-1005-F, R11B -> RMK1608-K-B-1005-F, R10B -> RMK1608-K-B-1005-F, C68A -> CT41G-0603-X7R-50V-103-K-N, R62 -> RMK1608-K-B-100-F, C72E -> CT41G-0603-X7R-50V-103-K-N, C72D -> CT41G-0603-X7R-50V-103-K-N, C72C -> CT41G-0603-X7R-50V-103-K-N, C72B -> CT41G-0603-X7R-50V-103-K-N, C72A -> CT41G-0603-X7R-50V-103-K-N, C68E -> CT41G-0603-X7R-50V-103-K-N, C68B -> CT41G-0603-X7R-50V-103-K-N, C68C -> CT41G-0603-X7R-50V-103-K-N, C68D -> CT41G-0603-X7R-50V-103-K-N, R13A -> RMK1608-K-B-100-F, R48 -> RMK1608-K-B-100-F, R54E -> RMK1608-K-B-100-F, R54A -> RMK1608-K-B-100-F, R54D -> RMK1608-K-B-100-F, R54B -> RMK1608-K-B-100-F, R54C -> RMK1608-K-B-100-F, R13B -> RMK1608-K-B-100-F, R35 -> RMK1608-K-B-100-F, R42 -> RMK1608-K-B-100-F, R29 -> RMK1608-K-B-100-F, R58B -> RMK1608-K-B-100-F, R65 -> RMK1608-K-B-100-F, R58E -> RMK1608-K-B-100-F, R58A -> RMK1608-K-B-100-F, R58D -> RMK1608-K-B-100-F, R58C -> RMK1608-K-B-100-F, R5C -> RMK1608-K-B-100-F, R5B -> RMK1608-K-B-100-F, R2E -> RMK1608-K-B-100-F, R2D -> RMK1608-K-B-100-F, R5A -> RMK1608-K-B-100-F, R5D -> RMK1608-K-B-100-F, R2C -> RMK1608-K-B-100-F, R2B -> RMK1608-K-B-100-F, R2A -> RMK1608-K-B-100-F, R5E -> RMK1608-K-B-100-F, R1E -> RMK1608-K-B-100-F, R1D -> RMK1608-K-B-100-F, R1C -> RMK1608-K-B-100-F, R1B -> RMK1608-K-B-100-F, R1A -> RMK1608-K-B-100-F, C10A -> CT41G-0805-X7R-10V-106-M-N, C14A -> CT41G-0805-X7R-10V-106-M-N, C19A -> CT41G-0805-X7R-10V-106-M-N, C13B -> CT41G-0805-X7R-10V-106-M-N, C10B -> CT41G-0805-X7R-10V-106-M-N, C11B -> CT41G-0805-X7R-10V-106-M-N, C14B -> CT41G-0805-X7R-10V-106-M-N, C13A -> CT41G-0805-X7R-10V-106-M-N, C11A -> CT41G-0805-X7R-10V-106-M-N, C19B -> CT41G-0805-X7R-10V-106-M-N, C25A -> CC41-0402-CG-50V-120-J-N, C26A -> CC41-0402-CG-50V-120-J-N, C29A -> CC41-0402-CG-50V-120-J-N, C25B -> CC41-0402-CG-50V-120-J-N, C28A -> CC41-0402-CG-50V-120-J-N, C28B -> CC41-0402-CG-50V-120-J-N, C26B -> CC41-0402-CG-50V-120-J-N, C29B -> CC41-0402-CG-50V-120-J-N, C20A -> CT41G-0805-X5R-10V-226-M-N, C20B -> CT41G-0805-X5R-10V-226-M-N, R21 -> RMK1608-K-B-470-F, R27 -> RMK1608-K-B-470-F, R32 -> RMK1608-K-B-470-F, R45 -> RMK1608-K-B-470-F, R44 -> RMK1608-K-B-470-F, R46 -> RMK1608-K-B-470-F, R31 -> RMK1608-K-B-470-F, R43 -> RMK1608-K-B-470-F, R33 -> RMK1608-K-B-470-F, R30 -> RMK1608-K-B-470-F, R12A -> RMK1608-K-B-1003-F, R12B -> RMK1608-K-B-1003-F, R17A -> RMK1608-K-B-1003-F, R14B -> RMK1608-K-B-1003-F, R14A -> RMK1608-K-B-1003-F, R17B -> RMK1608-K-B-1003-F, R38 -> RMK1608-Y-B-1003-B, R51 -> RMK1608-Y-B-1003-B, C34 -> CT41G-0603-X7R-50V-104-K-N, C6B -> CT41G-0603-X7R-50V-104-K-N, C3A -> CT41G-0603-X7R-50V-104-K-N, C7A -> CT41G-0603-X7R-50V-104-K-N, C4E -> CT41G-0603-X7R-50V-104-K-N, C4A -> CT41G-0603-X7R-50V-104-K-N, C6D -> CT41G-0603-X7R-50V-104-K-N, C3B -> CT41G-0603-X7R-50V-104-K-N, C6A -> CT41G-0603-X7R-50V-104-K-N, C4C -> CT41G-0603-X7R-50V-104-K-N, C6C -> CT41G-0603-X7R-50V-104-K-N, C4B -> CT41G-0603-X7R-50V-104-K-N, C3E -> CT41G-0603-X7R-50V-104-K-N, C3D -> CT41G-0603-X7R-50V-104-K-N, C6E -> CT41G-0603-X7R-50V-104-K-N, C4D -> CT41G-0603-X7R-50V-104-K-N, C3C -> CT41G-0603-X7R-50V-104-K-N, C16B -> CT41G-0603-X7R-50V-104-K-N, C21B -> CT41G-0603-X7R-50V-104-K-N, C17A -> CT41G-0603-X7R-50V-104-K-N, C30B -> CT41G-0603-X7R-50V-104-K-N, C30A -> CT41G-0603-X7R-50V-104-K-N, C12A -> CT41G-0603-X7R-50V-104-K-N, C12B -> CT41G-0603-X7R-50V-104-K-N, C7E -> CT41G-0603-X7R-50V-104-K-N, C22B -> CT41G-0603-X7R-50V-104-K-N, C31A -> CT41G-0603-X7R-50V-104-K-N, C7B -> CT41G-0603-X7R-50V-104-K-N, C9A -> CT41G-0603-X7R-50V-104-K-N, C7C -> CT41G-0603-X7R-50V-104-K-N, C9B -> CT41G-0603-X7R-50V-104-K-N, C21A -> CT41G-0603-X7R-50V-104-K-N, C7D -> CT41G-0603-X7R-50V-104-K-N, C18B -> CT41G-0603-X7R-50V-104-K-N, C18A -> CT41G-0603-X7R-50V-104-K-N, C31B -> CT41G-0603-X7R-50V-104-K-N, C17B -> CT41G-0603-X7R-50V-104-K-N, C22A -> CT41G-0603-X7R-50V-104-K-N, C16A -> CT41G-0603-X7R-50V-104-K-N, C15B -> CT41G-0603-X7R-50V-104-K-N, C15A -> CT41G-0603-X7R-50V-104-K-N, C71A -> CT41G-0603-X7R-50V-104-K-N, C67E -> CT41G-0603-X7R-50V-104-K-N, C70E -> CT41G-0603-X7R-50V-104-K-N, C67D -> CT41G-0603-X7R-50V-104-K-N, C70D -> CT41G-0603-X7R-50V-104-K-N, C70C -> CT41G-0603-X7R-50V-104-K-N, C67C -> CT41G-0603-X7R-50V-104-K-N, C70B -> CT41G-0603-X7R-50V-104-K-N, C70A -> CT41G-0603-X7R-50V-104-K-N, C67B -> CT41G-0603-X7R-50V-104-K-N, C69E -> CT41G-0603-X7R-50V-104-K-N, C77 -> CT41G-0603-X7R-50V-104-K-N, C69D -> CT41G-0603-X7R-50V-104-K-N, C71E -> CT41G-0603-X7R-50V-104-K-N, C67A -> CT41G-0603-X7R-50V-104-K-N, C75 -> CT41G-0603-X7R-50V-104-K-N, C69C -> CT41G-0603-X7R-50V-104-K-N, C74 -> CT41G-0603-X7R-50V-104-K-N, C69B -> CT41G-0603-X7R-50V-104-K-N, C71D -> CT41G-0603-X7R-50V-104-K-N, C66E -> CT41G-0603-X7R-50V-104-K-N, C69A -> CT41G-0603-X7R-50V-104-K-N, C73D -> CT41G-0603-X7R-50V-104-K-N, C66C -> CT41G-0603-X7R-50V-104-K-N, C66D -> CT41G-0603-X7R-50V-104-K-N, C73C -> CT41G-0603-X7R-50V-104-K-N, C73A -> CT41G-0603-X7R-50V-104-K-N, C73B -> CT41G-0603-X7R-50V-104-K-N, C71C -> CT41G-0603-X7R-50V-104-K-N, C71B -> CT41G-0603-X7R-50V-104-K-N, C66A -> CT41G-0603-X7R-50V-104-K-N, C66B -> CT41G-0603-X7R-50V-104-K-N, C73E -> CT41G-0603-X7R-50V-104-K-N, C33 -> CC41-0603-CG-50V-101-J-N, C5B -> CC41-0603-CG-50V-101-J-N, C5D -> CC41-0603-CG-50V-101-J-N, C5E -> CC41-0603-CG-50V-101-J-N, C5A -> CC41-0603-CG-50V-101-J-N, C5C -> CC41-0603-CG-50V-101-J-N, C8B -> CC41-0603-CG-50V-101-J-N, C8A -> CC41-0603-CG-50V-101-J-N, C23B -> CC41-0402-CG-50V-101-J-N, C23A -> CC41-0402-CG-50V-101-J-N, C8D -> CC41-0603-CG-50V-101-J-N, C8E -> CC41-0603-CG-50V-101-J-N, C8C -> CC41-0603-CG-50V-101-J-N, C24A -> CC41-0402-CG-50V-101-J-N, C76 -> CC41-0603-CG-50V-101-J-N, C24B -> CC41-0402-CG-50V-101-J-N, C50 -> CT41G-0603-X7R-16V-274-K-N, C61 -> CT41G-0603-X7R-50V-334-K-N, C46 -> CT41G-0603-X7R-50V-334-K-N, R15 -> RMK1608-K-B-3300-F, R8B -> RMK1608-K-B-4700-F, R16 -> RMK1608-K-B-3300-F, R8A -> RMK1608-K-B-4700-F, C47 -> CC41-0603-CG-50V-471-J-N, C62 -> CC41-0603-CG-50V-471-J-N, L1A -> NR201610-2R2M, L1B -> NR201610-2R2M, X1A -> JA144-24-C10-B3-D10-E, X1B -> JA144-24-C10-B3-D10-E
工业级阻感容: not fitted BT1A BT1B J1A J1B J1C J1D J1E P1A P1B P2 P3 P4 P5 P7 P8A P8B P8C P8D P8E